# Altium project ADMDSP.PrjPCB
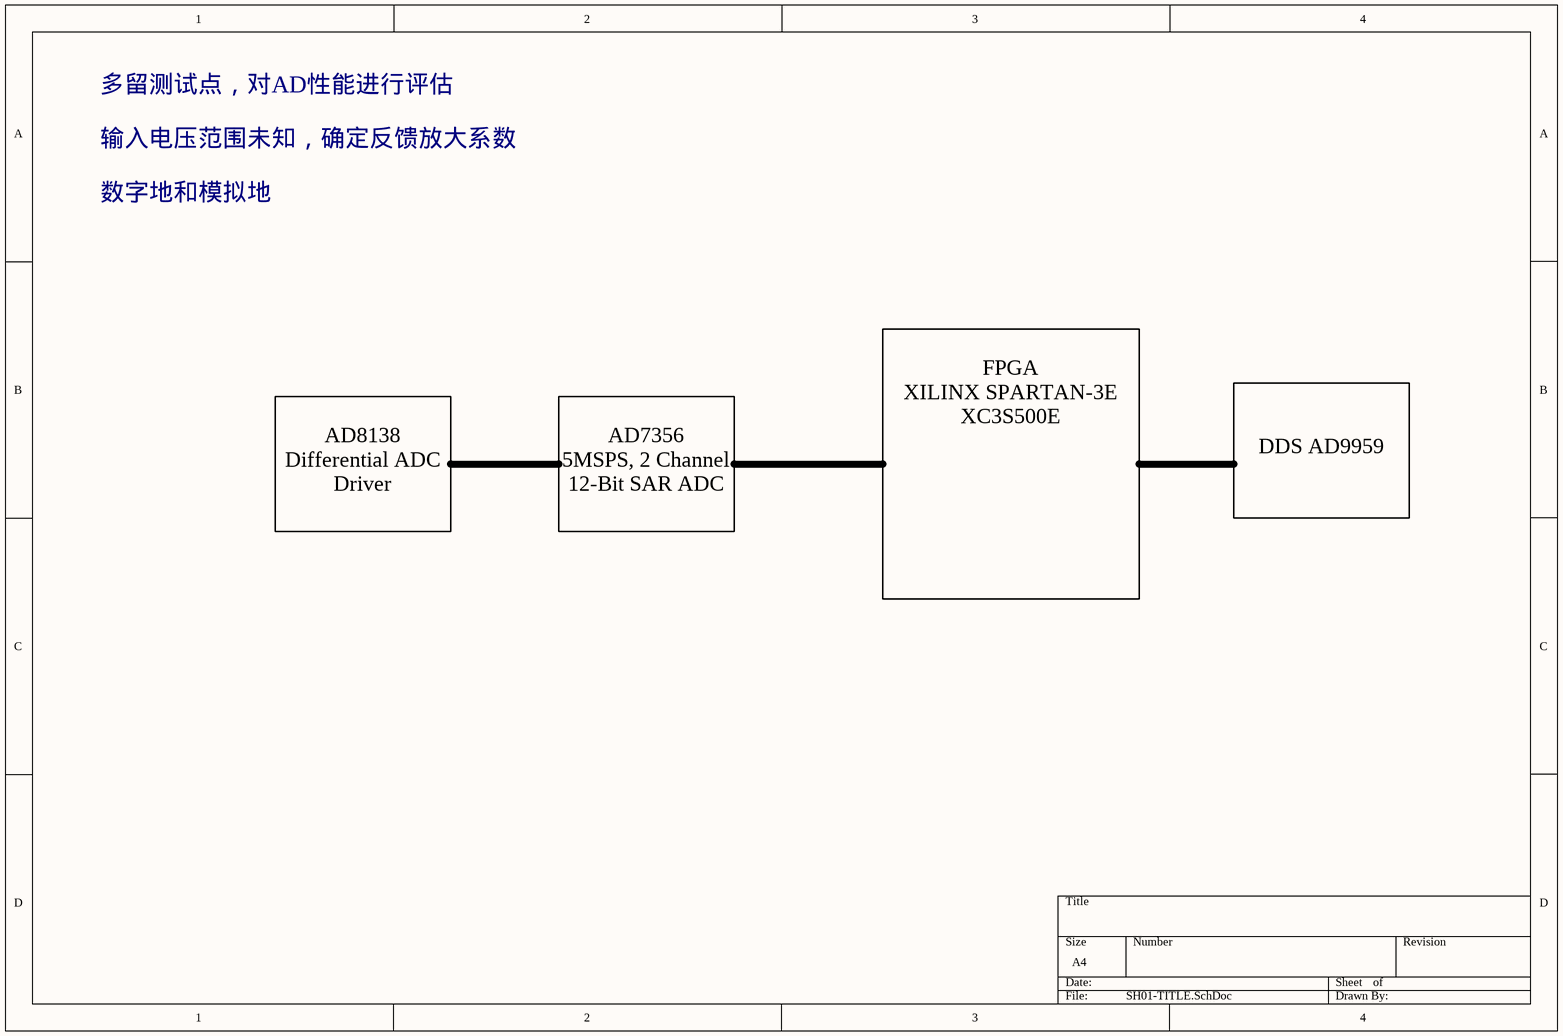
[diagram p0: SH01-TITLE.SchDoc]
10 sheets, 288 parts. Net scope: global (net labels, ports and power ports of the same name join across sheets).
Board file: AMDDSP.PcbDoc
Sheets:
  SH01-TITLE.SchDoc
  SH02-PERI.SchDoc
  SH03-AD.SchDoc
  SH04-DSP.SchDoc
  SH06-UI.SchDoc
  SH05-DDS.SchDoc
  SH07-COREPWR.SchDoc
  SH08-PWR1.SchDoc
  SH09-PWR2.SchDoc
  SH10-ASSI.SchDoc

## Sheet SH01-TITLE.SchDoc
size A4

### Notes on the sheet
- 多留测试点，对AD性能进行评估
- 输入电压范围未知，确定反馈放大系数
- 数字地和模拟地
- DDS AD9959
- AD8138
  Differential ADC
  Driver
- AD7356
  5MSPS, 2 Channel
  12-Bit SAR ADC
- FPGA
  XILINX SPARTAN-3E
  XC3S500E

## Sheet SH02-PERI.SchDoc
size A4
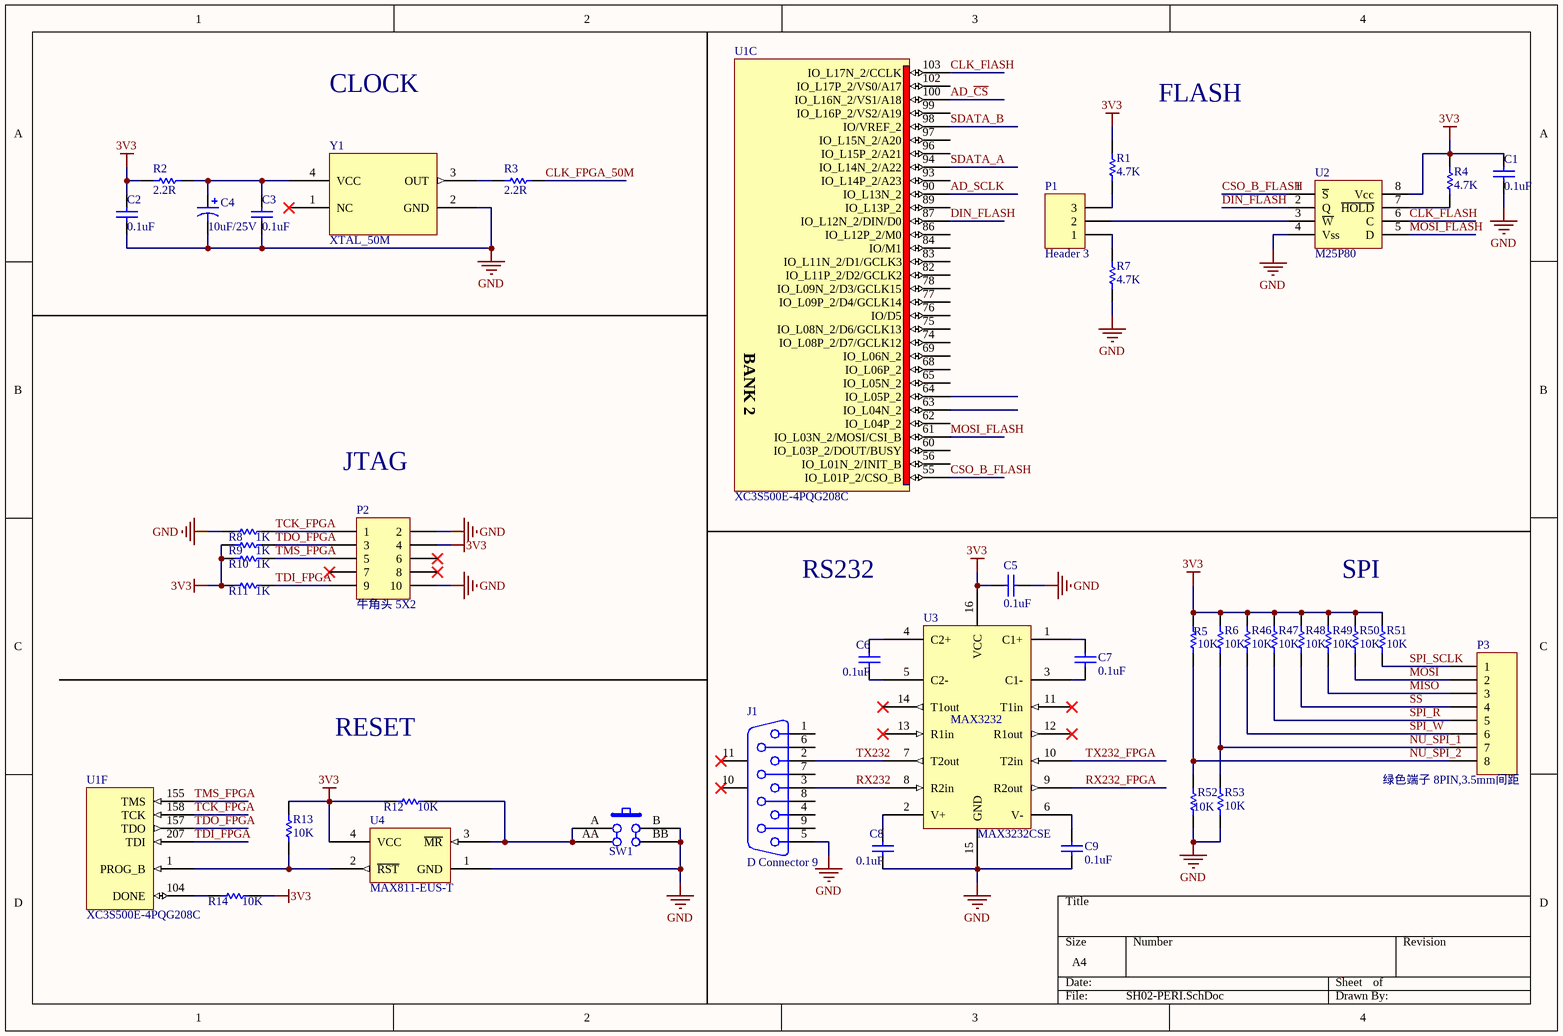
[diagram p1: SH02-PERI.SchDoc]

### Parts
(Parts that share a designator on the sheet are numbered #1, #2 ... from top to bottom, then left to right.)
C1  value 0.1uF  [1608[0603]]  (hidden comment: Cap,0.1uF/0603)
C2  value 0.1uF  [1608[0603]]  (hidden comment: Cap,0.1uF/0603)
C3  value 0.1uF  [1608[0603]]  (hidden comment: Cap,0.1uF/0603)
C4  value 10uF/25V  [1206[3216]]  (hidden comment: Cap Pol,10uF/25V,1206)
C5  value 0.1uF  [1608[0603]]  (hidden comment: Cap,0.1uF/0603)
C6  value 0.1uF  [1608[0603]]  (hidden comment: Cap,0.1uF/0603)
C7  value 0.1uF  [1608[0603]]  (hidden comment: Cap,0.1uF/0603)
C8  value 0.1uF  [1608[0603]]  (hidden comment: Cap,0.1uF/0603)
C9  value 0.1uF  [1608[0603]]  (hidden comment: Cap,0.1uF/0603)
J1  D Connector 9  [DSUB1.385-2H9]
P1  Header 3  [HDR1X3]
P2  牛角头 5X2  [10Pin - JTAG]
P3  绿色端子 8PIN,3.5mm间距  [8PIN]
R1  value 4.7K  [1608[0603]]  (hidden comment: Res,4.7K/0603)
R2  value 2.2R  [1608[0603]]  (hidden comment: Res,2.2R/0603)
R3  value 2.2R  [1608[0603]]  (hidden comment: Res,2.2R/0603)
R4  value 4.7K  [1608[0603]]  (hidden comment: Res,4.7K/0603)
R5  value 10K  [1608[0603]]  (hidden comment: Res,10K/0603)
R6  value 10K  [1608[0603]]  (hidden comment: Res,10K/0603)
R7  value 4.7K  [1608[0603]]  (hidden comment: Res,4.7K/0603)
R8  value 1K  [1608[0603]]  (hidden comment: Res,1K/0603)
R9  value 1K  [1608[0603]]  (hidden comment: Res,1K/0603)
R10  value 1K  [1608[0603]]  (hidden comment: Res,1K/0603)
R11  value 1K  [1608[0603]]  (hidden comment: Res,1K/0603)
R12  value 10K  [1608[0603]]  (hidden comment: Res,10K/0603)
R13  value 10K  [1608[0603]]  (hidden comment: Res,10K/0603)
R14  value 10K  [1608[0603]]  (hidden comment: Res,10K/0603)
R46#1  value 10K  [1608[0603]]  (hidden comment: Res,10K/0603)
R47#1  value 10K  [1608[0603]]  (hidden comment: Res,10K/0603)
R48  value 10K  [1608[0603]]  (hidden comment: Res,10K/0603)
R49  value 10K  [1608[0603]]  (hidden comment: Res,10K/0603)
R50  value 10K  [1608[0603]]  (hidden comment: Res,10K/0603)
R51  value 10K  [1608[0603]]  (hidden comment: Res,10K/0603)
R52  value 10K  [1608[0603]]  (hidden comment: Res,10K/0603,NoPoP)
R53  value 10K  [1608[0603]]  (hidden comment: Res,10K/0603,NoPoP)
SW1  SW,EVQPLMA15_1  [PUSHBUTTONSW]  (value not drawn)
U1  XC3S500E-4PQG208C  [PQG208_N]  (parts C,F of 8)
U2  M25P80  [SOIC127P600X175-8N]
U3  MAX3232CSE  [NSO16]
U4  MAX811-EUS-T  [SOT143]
Y1  XTAL_50M  [CRY_4Pin_50M]

### Nets
3V3: C1.1 C2.1 C5.1 P2.4 R1.2 R2.1 R4.2 R5.1 R6.1 R9.2 R10.2 R11.2 R12.2 R13.1 R14.1 R46#1.1 R47#1.1 R48.1 R49.1 R50.1 R51.1 U2.8(Vcc) U3.16(VCC) U4.4(VCC)
GND: C1.2 C2.2 C3.2 C4.2 C5.2 C8.2 C9.1 J1.5 P2.2 P2.10 R7.1 R8.2 R52.2 R53.2 SW1.B SW1.BB U2.4(Vss) U3.15(GND) U4.1(GND) Y1.2(GND)
AD_~{CS}: U1.100(IO_L16N_2/VS1/A18)
AD_SCLK: U1.90(IO_L13N_2)
CLK_FLASH: U1.103(IO_L17N_2/CCLK) U2.6(C)
CLK_FPGA_50M: R3.2
CSO_B_FLASH: U1.55(IO_L01P_2/CSO_B) U2.1(~{S})
DIN_FLASH: U1.87(IO_L12N_2/DIN/D0) U2.2(Q)
MISO: P3.3 R49.2
MOSI: P3.2 R50.2
MOSI_FLASH: U1.61(IO_L03N_2/MOSI/CSI_B) U2.5(D)
NU_SPI_1: P3.7 R6.2 R53.1
NU_SPI_2: P3.8 R5.2 R52.1
RX232: J1.3 U3.8(R2in)
RX232_FPGA: U3.9(R2out)
SDATA_A: U1.94(IO_L14N_2/A22)
SDATA_B: U1.98(IO/VREF_2)
SPI_R: P3.5 R47#1.2
SPI_SCLK: P3.1 R51.2
SPI_W: P3.6 R46#1.2
SS: P3.4 R48.2
TCK_FPGA: P2.1 R8.1 U1.158(TCK)
TDI_FPGA: P2.9 R11.1 U1.207(TDI)
TDO_FPGA: P2.3 R9.1 U1.157(TDO)
TMS_FPGA: P2.5 R10.1 U1.155(TMS)
TX232: J1.2 U3.7(T2out)
TX232_FPGA: U3.10(T2in)
NetC3_1: C3.1 C4.1 R2.2 Y1.4(VCC)
NetC6_1: C6.1 U3.4(C2+)
NetC6_2: C6.2 U3.5(C2-)
NetC7_1: C7.1 U3.3(C1-)
NetC7_2: C7.2 U3.1(C1+)
NetC8_1: C8.1 U3.2(V+)
NetC9_2: C9.2 U3.6(V-)
NetP1_1: P1.1 R7.2
NetP1_2: P1.2 U2.3(~{W})
NetP1_3: P1.3 R1.1
NetR3_1: R3.1 Y1.3(OUT)
NetR4_1: R4.1 U2.7(~{HOLD})
NetR12_1: R12.1 SW1.A SW1.AA U4.3(~{MR})
NetR13_2: R13.2 U1.1(PROG_B) U4.2(~{RST})
NetR14_2: R14.2 U1.104(DONE)

Not connected (* = marked no-connect by the designer): J1 1 4 6 7 8 9 10(MH1)* 11(MH2)*; P2 6* 7* 8*; U1 56(IO_L01N_2/INIT_B) 60(IO_L03P_2/DOUT/BUSY) 62(IO_L04P_2) 63(IO_L04N_2) 64(IO_L05P_2) 65(IO_L05N_2) 68(IO_L06P_2) 69(IO_L06N_2) 74(IO_L08P_2/D7/GCLK12) 75(IO_L08N_2/D6/GCLK13) 76(IO/D5) 77(IO_L09P_2/D4/GCLK14) 78(IO_L09N_2/D3/GCLK15) 82(IO_L11P_2/D2/GCLK2) 83(IO_L11N_2/D1/GCLK3) 84(IO/M1) 86(IO_L12P_2/M0) 89(IO_L13P_2) 93(IO_L14P_2/A23) 96(IO_L15P_2/A21) 97(IO_L15N_2/A20) 99(IO_L16P_2/VS2/A19) 102(IO_L17P_2/VS0/A17); U3 11(T1in)* 12(R1out)* 13(R1in)* 14(T1out)*; Y1 1(NC)*

### Notes on the sheet
- CLOCK
- FLASH
- JTAG
- RS232
- SPI
- RESET
- (in symbol XC3S500E-4PQG208C, part C) BANK 2

### Library data of the parts
C1-C3 C5-C9 = Cap: Capacitor; Published: 8-Jun-2000; LatestRevisionDate: 17-Jul-2002; LatestRevisionNote: Re-released for DXP Platform.; PackageReference: RAD-0.3; Publisher: Altium Limited
C4 = Cap Pol1: Polarized Capacitor (Radial); Published: 8-Jun-2000; LatestRevisionDate: 17-Jul-2002; LatestRevisionNote: Re-released for DXP Platform.; PackageReference: RB7.6-15; Publisher: Altium Limited
J1 = D Connector 9: Receptacle Assembly, 9 Position, Right Angle; PackageDocument: O; Positions: 9; Published: 15-Jun-2001; LatestRevisionDate: 17-Jul-2002; LatestRevisionNote: Re-released for DXP Platform.; DatasheetDocument: 1-Sep-1999; PackageReference: 788750; Publisher: Altium Limited; Orientation: Right Angle; Gender: Receptacle
P1 = Header 3: Header, 3-Pin; LatestRevisionDate: 17-Jul-2002; LatestRevisionNote: Re-released for DXP Platform.; Publisher: Altium Limited
P2 = Header 5X2: Header, 5-Pin, Dual row; LatestRevisionDate: 17-Jul-2002; LatestRevisionNote: Re-released for DXP Platform.; Publisher: Altium Limited
P3 = Header 8: Header, 8-Pin; LatestRevisionDate: 17-Jul-2002; LatestRevisionNote: Re-released for DXP Platform.; Publisher: Altium Limited
R1-R14 R46#1 R47#1 R48-R53 = Res1: Resistor; Published: 8-Jun-2000; LatestRevisionDate: 17-Jul-2002; LatestRevisionNote: Re-released for DXP Platform.; PackageReference: AXIAL-0.3; Publisher: Altium Limited
SW1 = PUSHBUTTON SW
U1 = XC3S500E-4PQG208C: Spartan-3E 1.2V FPGA, 158 User I/Os, 208-Pin Pb-Free PQFP, Standard Performance, Commercial Grade; Published: 6-Jun-2005; LatestRevisionDate: 13-Apr-2006; LatestRevisionNote: IPC-7351 Footprint Added.; DatasheetVersion: 16-Mar-2007; PackageVersion: ver1.2, Jun-2004; PackageReference: PQG208; Publisher: Altium Limited; PackageDescription: 208-Pin Plastic Quad Flat Pack (PQG208) - Pb-Free; Code_JEDEC: MS-029-FA-1; ComponentLink1Description: Manufacturer Link; ComponentLink1URL: http://www.xilinx.com/products/silicon_solutions/fpgas/spartan_series/spartan3e_fpgas/index.htm; ComponentLink2Description: Datasheet; ComponentLink2URL: http://direct.xilinx.com/bvdocs/publications/ds312.pdf
U3 = MAX3232: Text Field1: 60; Text Field2: 150
U4 = MAX811
Y1 = XTAL

## Sheet SH03-AD.SchDoc
size A4
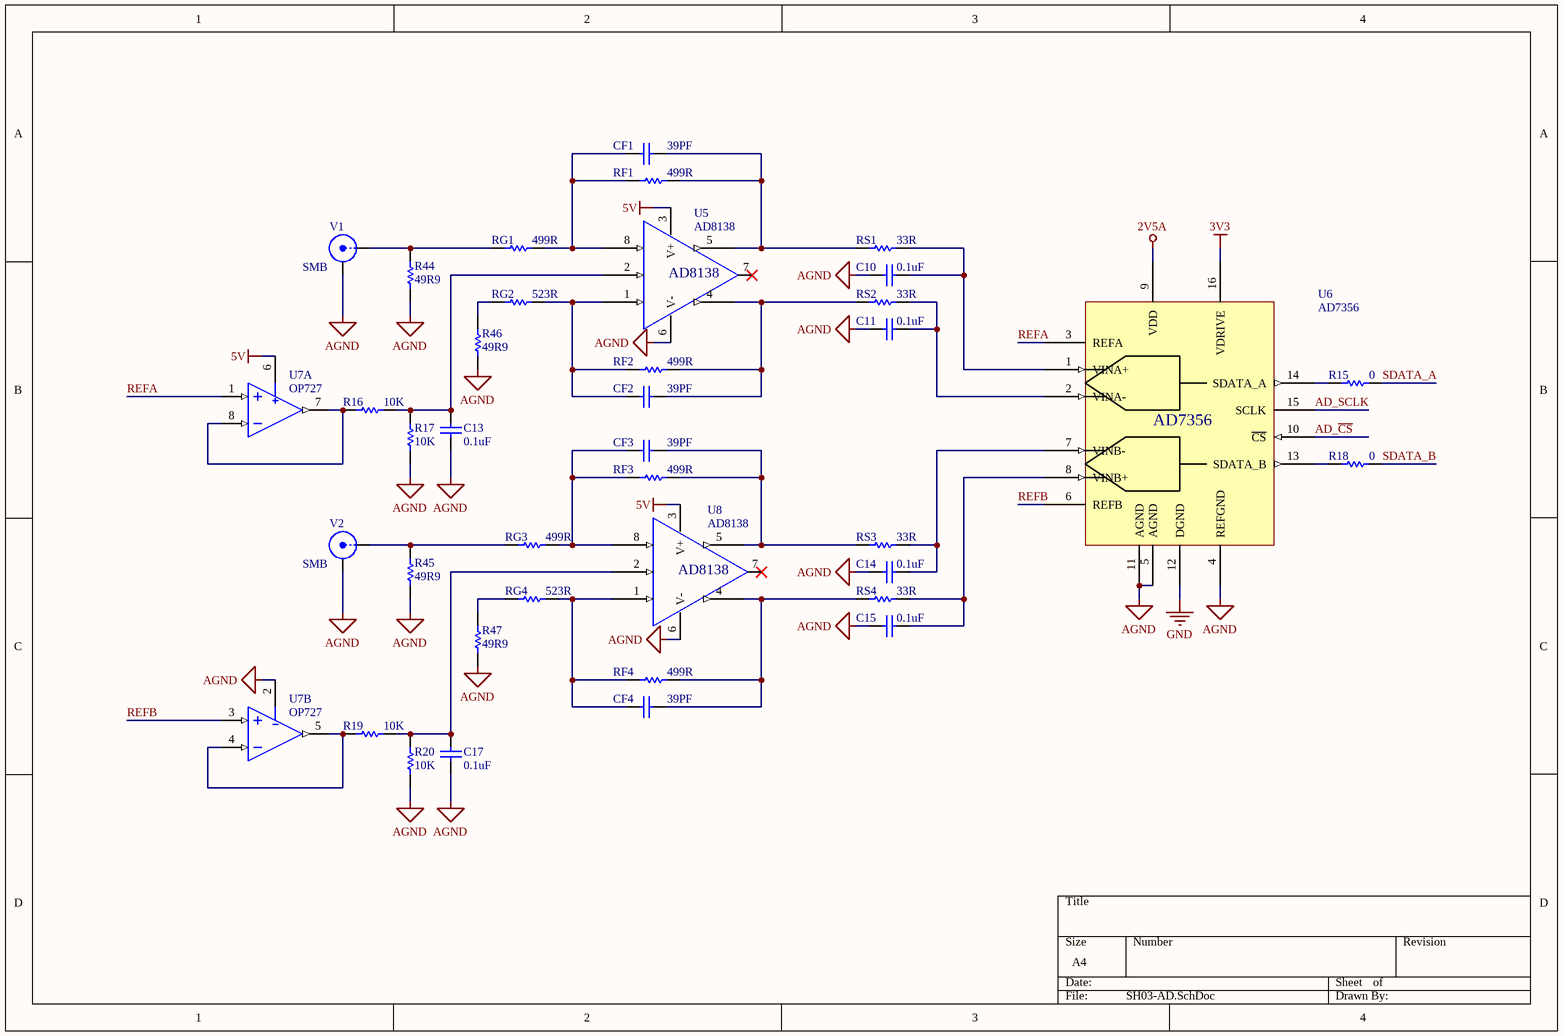
[diagram p2: SH03-AD.SchDoc]

### Parts
(Parts that share a designator on the sheet are numbered #1, #2 ... from top to bottom, then left to right.)
C10  value 0.1uF  [1608[0603]]  (hidden comment: Cap,0.1uF/0603)
C11  value 0.1uF  [1608[0603]]  (hidden comment: Cap,0.1uF/0603)
C13  value 0.1uF  [1608[0603]]  (hidden comment: Cap,0.1uF/0603)
C14  value 0.1uF  [1608[0603]]  (hidden comment: Cap,0.1uF/0603)
C15  value 0.1uF  [1608[0603]]  (hidden comment: Cap,0.1uF/0603)
C17  value 0.1uF  [1608[0603]]  (hidden comment: Cap,0.1uF/0603)
CF1  value 39PF  [1608[0603]]  (hidden comment: Cap,39PF/0603)
CF2  value 39PF  [1608[0603]]  (hidden comment: Cap,39PF/0603)
CF3  value 39PF  [1608[0603]]  (hidden comment: Cap,39PF/0603)
CF4  value 39PF  [1608[0603]]  (hidden comment: Cap,39PF/0603)
R15  value 0  [1608[0603]]  (hidden comment: Res,0R/0603)
R16  value 10K  [1608[0603]]  (hidden comment: Res,10K/0603)
R17  value 10K  [1608[0603]]  (hidden comment: Res,10K/0603)
R18  value 0  [1608[0603]]  (hidden comment: Res,0R/0603)
R19  value 10K  [1608[0603]]  (hidden comment: Res,10K/0603)
R20  value 10K  [1608[0603]]  (hidden comment: Res,10K/0603)
R44  value 49R9  [1608[0603]]  (hidden comment: Res,49R9/0603)
R45  value 49R9  [1608[0603]]  (hidden comment: Res,49R9/0603)
R46#2  value 49R9  [1608[0603]]  (hidden comment: Res,49R9/0603)
R47#2  value 49R9  [1608[0603]]  (hidden comment: Res,49R9/0603)
RF1  value 499R  [1608[0603]]  (hidden comment: Res,499R/0603)
RF2  value 499R  [1608[0603]]  (hidden comment: Res,499R/0603)
RF3  value 499R  [1608[0603]]  (hidden comment: Res,499R/0603)
RF4  value 499R  [1608[0603]]  (hidden comment: Res,499R/0603)
RG1  value 499R  [1608[0603]]  (hidden comment: Res,499R/0603)
RG2  value 523R  [1608[0603]]  (hidden comment: Res,523R/0603)
RG3  value 499R  [1608[0603]]  (hidden comment: Res,499R/0603)
RG4  value 523R  [1608[0603]]  (hidden comment: Res,523R/0603)
RS1  value 33R  [1608[0603]]  (hidden comment: Res,33R/0603)
RS2  value 33R  [1608[0603]]  (hidden comment: Res,33R/0603)
RS3  value 33R  [1608[0603]]  (hidden comment: Res,33R/0603)
RS4  value 33R  [1608[0603]]  (hidden comment: Res,33R/0603)
U5  AD8138  [SOIC127P600X175-8N]
U6  AD7356  [TSOP65P640X120-16N]
U7  OP727  [SOIC127P600X175-8N]  (parts A,B of 2)
U8  AD8138  [SOIC127P600X175-8N]
V1  SMB  [SMB_V-RJ45]
V2  SMB  [SMB_V-RJ45]

### Nets
2V5A: U6.9(VDD)
3V3: U6.16(VDRIVE)
5V: U5.3(V+) U7.6(V+) U8.3(V+)  [project net A_LCD]
AGND: C10.2 C11.2 C13.2 C14.2 C15.2 C17.2 R17.1 R20.1 R44.2 R45.2 R46#2.2 R47#2.2 U5.6(V-) U6.4(REFGND) U6.5(AGND) U6.11(AGND) U7.2(V-) U8.6(V-) V1.2(Y) V2.2(Y)
GND: U6.12(DGND)
AD_~{CS}: U6.10(~{CS})
AD_SCLK: U6.15(SCLK)
REFA: U6.3(REFA) U7.1(+INA)
REFB: U6.6(REFB) U7.3(+INB)
SDATA_A: R15.2
SDATA_B: R18.2
NetC10_1: C10.1 RS1.1 U6.1(VINA+)
NetC11_1: C11.1 RS2.1 U6.2(VINA-)
NetC13_1: C13.1 R16.2 R17.2 U5.2(VOCM)
NetC14_1: C14.1 RS3.1 U6.7(VINB-)
NetC15_1: C15.1 RS4.1 U6.8(VINB+)
NetC17_1: C17.1 R19.2 R20.2 U8.2(VOCM)
NetCF1_1: CF1.1 RF1.1 RS1.2 U5.5(-OUT)
NetCF1_2: CF1.2 RF1.2 RG1.1 U5.8(+IN)
NetCF2_1: CF2.1 RF2.1 RS2.2 U5.4(+OUT)
NetCF2_2: CF2.2 RF2.2 RG2.1 U5.1(-IN)
NetCF3_1: CF3.1 RF3.1 RS3.2 U8.5(-OUT)
NetCF3_2: CF3.2 RF3.2 RG3.1 U8.8(+IN)
NetCF4_1: CF4.1 RF4.1 RS4.2 U8.4(+OUT)
NetCF4_2: CF4.2 RF4.2 RG4.1 U8.1(-IN)
NetR15_1: R15.1 U6.14(SDATA_A)
NetR16_1: R16.1 U7.7(OUTA) U7.8(-INA)
NetR18_1: R18.1 U6.13(SDATA_B)
NetR19_1: R19.1 U7.4(-INB) U7.5(OUTB)
NetR44_1: R44.1 RG1.2 V1.1(X)
NetR45_1: R45.1 RG3.2 V2.1(X)
NetR46#2_1: R46#2.1 RG2.2
NetR47#2_1: R47#2.1 RG4.2

Not connected (* = marked no-connect by the designer): U5 7(NC)*; U8 7(NC)*

### Library data of the parts
C10 C11 C13-C15 C17 CF1-CF4 = Cap: Capacitor; Published: 8-Jun-2000; LatestRevisionDate: 17-Jul-2002; LatestRevisionNote: Re-released for DXP Platform.; PackageReference: RAD-0.3; Publisher: Altium Limited
R15-R20 R44 R45 R46#2 R47#2 RF1-RF4 RG1-RG4 RS1-RS4 = Res1: Resistor; Published: 8-Jun-2000; LatestRevisionDate: 17-Jul-2002; LatestRevisionNote: Re-released for DXP Platform.; PackageReference: AXIAL-0.3; Publisher: Altium Limited
U5 U8 = AD8138: Low Distortion  Differential ADC Driver; Note: Pin 2 is analog ground; Published: 8-Jun-2000; LatestRevisionDate: 04-Mar-2005; LatestRevisionNote: Stylized 3D Model Added.; DatasheetVersion: REV.B 1998; PackageVersion: revA; PackageReference: N-8; Publisher: Altium Limited; PackageDescription: DIP; 8 Leads; Row Spacing 7.62 mm; Pitch 2.54 mm; ComponentLink1Description: Manufacturer Link; ComponentLink1URL: http://www.analog.com/en/prod/0%2C2877%2CAD626%2C00.html; ComponentLink2Description: Datasheet; ComponentLink2URL: http://www.analog.com/UploadedFiles/Data_Sheets/441354443AD626_d.pdf
U6 = AD7356: Differential Input, Dual, Simultaneous  Sampling, 5 MSPS, 12-Bit, SAR ADC
U7 = AMP_OP727: Precision Micropower  Single-Supply Operational Amplifiers; Published: 8-Jun-2000; LatestRevisionDate: 17-Jul-2002; LatestRevisionNote: Re-released for DXP Platform.; DatasheetVersion: 1992; PackageVersion: revC, 1990; PackageReference: H-12A; Publisher: Altium Limited; PackageDescription: Can; 12 Leads; 10.16 mm Square Array; Lead Dia. 0.53 mm (max); ComponentLink1Description: Manufacturer Link; ComponentLink1URL: http://www.analog.com/
V1 V2 = SMB: SMB Straight Connector; LatestRevisionDate: 17-Jul-2002; LatestRevisionNote: Re-released for DXP Platform.; Publisher: Altium Limited

## Sheet SH04-DSP.SchDoc
size A4
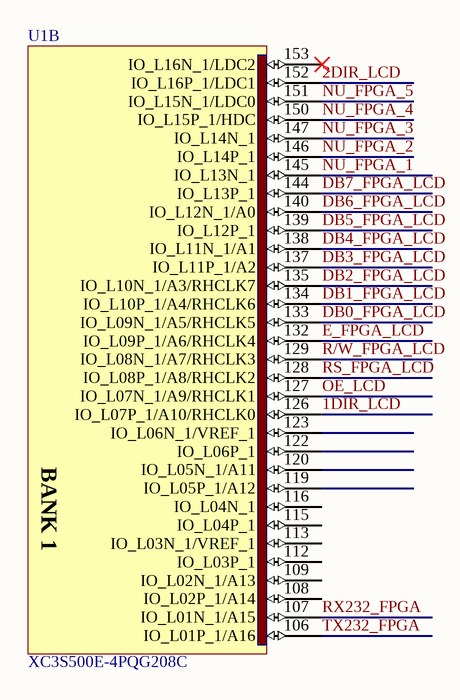
[diagram p3: SH04-DSP.SchDoc]

### Parts
U1  XC3S500E-4PQG208C  [PQG208_N]  (part B of 8)

### Nets
1DIR_LCD: U1.126(IO_L07P_1/A10/RHCLK0)
2DIR_LCD: U1.152(IO_L16P_1/LDC1)
DB0_FPGA_LCD: U1.133(IO_L09N_1/A5/RHCLK5)
DB1_FPGA_LCD: U1.134(IO_L10P_1/A4/RHCLK6)
DB2_FPGA_LCD: U1.135(IO_L10N_1/A3/RHCLK7)
DB3_FPGA_LCD: U1.137(IO_L11P_1/A2)
DB4_FPGA_LCD: U1.138(IO_L11N_1/A1)
DB5_FPGA_LCD: U1.139(IO_L12P_1)
DB6_FPGA_LCD: U1.140(IO_L12N_1/A0)
DB7_FPGA_LCD: U1.144(IO_L13P_1)
E_FPGA_LCD: U1.132(IO_L09P_1/A6/RHCLK4)
NU_FPGA_1: U1.145(IO_L13N_1)
NU_FPGA_2: U1.146(IO_L14P_1)
NU_FPGA_3: U1.147(IO_L14N_1)
NU_FPGA_4: U1.150(IO_L15P_1/HDC)
NU_FPGA_5: U1.151(IO_L15N_1/LDC0)
~{OE}_LCD: U1.127(IO_L07N_1/A9/RHCLK1)
R/W_FPGA_LCD: U1.129(IO_L08N_1/A7/RHCLK3)
RS_FPGA_LCD: U1.128(IO_L08P_1/A8/RHCLK2)
RX232_FPGA: U1.107(IO_L01N_1/A15)
TX232_FPGA: U1.106(IO_L01P_1/A16)

Not connected (* = marked no-connect by the designer): U1 108(IO_L02P_1/A14) 109(IO_L02N_1/A13) 112(IO_L03P_1) 113(IO_L03N_1/VREF_1) 115(IO_L04P_1) 116(IO_L04N_1) 119(IO_L05P_1/A12) 120(IO_L05N_1/A11) 122(IO_L06P_1) 123(IO_L06N_1/VREF_1) 153(IO_L16N_1/LDC2)*

### Notes on the sheet
- (in symbol XC3S500E-4PQG208C, part B) BANK 1

### Library data of the parts
U1 = XC3S500E-4PQG208C: as U1 on sheet SH02-PERI; Published: 6-Jun-2005; LatestRevisionDate: 13-Apr-2006; LatestRevisionNote: IPC-7351 Footprint Added.; DatasheetVersion: 16-Mar-2007; PackageVersion: ver1.2, Jun-2004; PackageReference: PQG208; Publisher: Altium Limited; PackageDescription: 208-Pin Plastic Quad Flat Pack (PQG208) - Pb-Free; Code_JEDEC: MS-029-FA-1; ComponentLink1Description: Manufacturer Link; ComponentLink1URL: http://www.xilinx.com/products/silicon_solutions/fpgas/spartan_series/spartan3e_fpgas/index.htm; ComponentLink2Description: Datasheet; ComponentLink2URL: http://direct.xilinx.com/bvdocs/publications/ds312.pdf

## Sheet SH06-UI.SchDoc
size A4
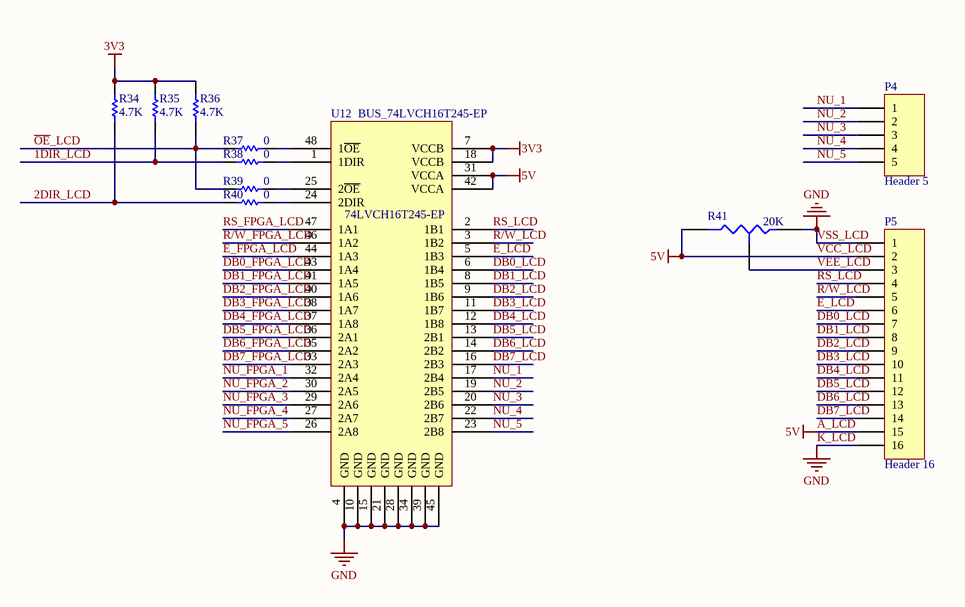
[diagram p4: SH06-UI.SchDoc]

### Parts
P4  Header 5  [HDR1X5]
P5  Header 16  [HDR1X16]
R34  value 4.7K  [1608[0603]]  (hidden comment: Res,4.7K/0603)
R35  value 4.7K  [1608[0603]]  (hidden comment: Res,4.7K/0603)
R36  value 4.7K  [1608[0603]]  (hidden comment: Res,4.7K/0603)
R37  value 0  [1608[0603]]  (hidden comment: Res,0R/0603)
R38  value 0  [1608[0603]]  (hidden comment: Res,0R/0603)
R39  value 0  [1608[0603]]  (hidden comment: Res,0R/0603)
R40  value 0  [1608[0603]]  (hidden comment: Res,0R/0603)
R41  value 20K  [RES-adj]  (hidden comment: Res Adj,20K)
U12  BUS_74LVCH16T245-EP  [TSSOP50P810X120-48N]

### Nets
3V3: R34.2 R35.2 R36.2 U12.7(VCCB) U12.18(VCCB)
A_LCD: P5.2 P5.15 R41.2(B) U12.31(VCCA) U12.42(VCCA)  [also labelled 5V, VCC_LCD]
GND: P5.1 P5.16 R41.1(A) U12.4(GND) U12.10(GND) U12.15(GND) U12.21(GND) U12.28(GND) U12.34(GND) U12.39(GND) U12.45(GND)  [also labelled K_LCD, VSS_LCD]
1DIR_LCD: R35.1 R38.1
2DIR_LCD: R34.1 R40.1
DB0_FPGA_LCD: U12.43(1A4)
DB0_LCD: P5.7 U12.6(1B4)
DB1_FPGA_LCD: U12.41(1A5)
DB1_LCD: P5.8 U12.8(1B5)
DB2_FPGA_LCD: U12.40(1A6)
DB2_LCD: P5.9 U12.9(1B6)
DB3_FPGA_LCD: U12.38(1A7)
DB3_LCD: P5.10 U12.11(1B7)
DB4_FPGA_LCD: U12.37(1A8)
DB4_LCD: P5.11 U12.12(1B8)
DB5_FPGA_LCD: U12.36(2A1)
DB5_LCD: P5.12 U12.13(2B1)
DB6_FPGA_LCD: U12.35(2A2)
DB6_LCD: P5.13 U12.14(2B2)
DB7_FPGA_LCD: U12.33(2A3)
DB7_LCD: P5.14 U12.16(2B3)
E_FPGA_LCD: U12.44(1A3)
E_LCD: P5.6 U12.5(1B3)
NU_1: P4.1 U12.17(2B4)
NU_2: P4.2 U12.19(2B5)
NU_3: P4.3 U12.20(2B6)
NU_4: P4.4 U12.22(2B7)
NU_5: P4.5 U12.23(2B8)
NU_FPGA_1: U12.32(2A4)
NU_FPGA_2: U12.30(2A5)
NU_FPGA_3: U12.29(2A6)
NU_FPGA_4: U12.27(2A7)
NU_FPGA_5: U12.26(2A8)
~{OE}_LCD: R36.1 R37.1 R39.1
R/W_FPGA_LCD: U12.46(1A2)
R/W_LCD: P5.5 U12.3(1B2)
RS_FPGA_LCD: U12.47(1A1)
RS_LCD: P5.4 U12.2(1B1)
VEE_LCD: P5.3 R41.3(TAP)
NetR37_2: R37.2 U12.48(1~{OE})
NetR38_2: R38.2 U12.1(1DIR)
NetR39_2: R39.2 U12.25(2~{OE})
NetR40_2: R40.2 U12.24(2DIR)

### Notes on the sheet
- (in symbol BUS_74LVCH16T245-EP) 74LVCH16T245-EP

### Library data of the parts
P4 = Header 5: Header, 5-Pin; LatestRevisionDate: 17-Jul-2002; LatestRevisionNote: Re-released for DXP Platform.; Publisher: Altium Limited
P5 = Header 16: Header, 16-Pin; LatestRevisionDate: 17-Jul-2002; LatestRevisionNote: Re-released for DXP Platform.; Publisher: Altium Limited
R34-R40 = Res1: Resistor; Published: 8-Jun-2000; LatestRevisionDate: 17-Jul-2002; LatestRevisionNote: Re-released for DXP Platform.; PackageReference: AXIAL-0.3; Publisher: Altium Limited
R41 = Res Tap: Tapped Resistor; Sim Note: Enter the Resistance value and the set point into parameter fields.; Set Position: 0.5; Published: 24-Mar-1999; LatestRevisionDate: 17-Jul-2002; LatestRevisionNote: Re-released for DXP Platform.; PackageReference: VR3; Publisher: Altium Limited

## Sheet SH05-DDS.SchDoc: ADM_PHASE_FPGA
size A4
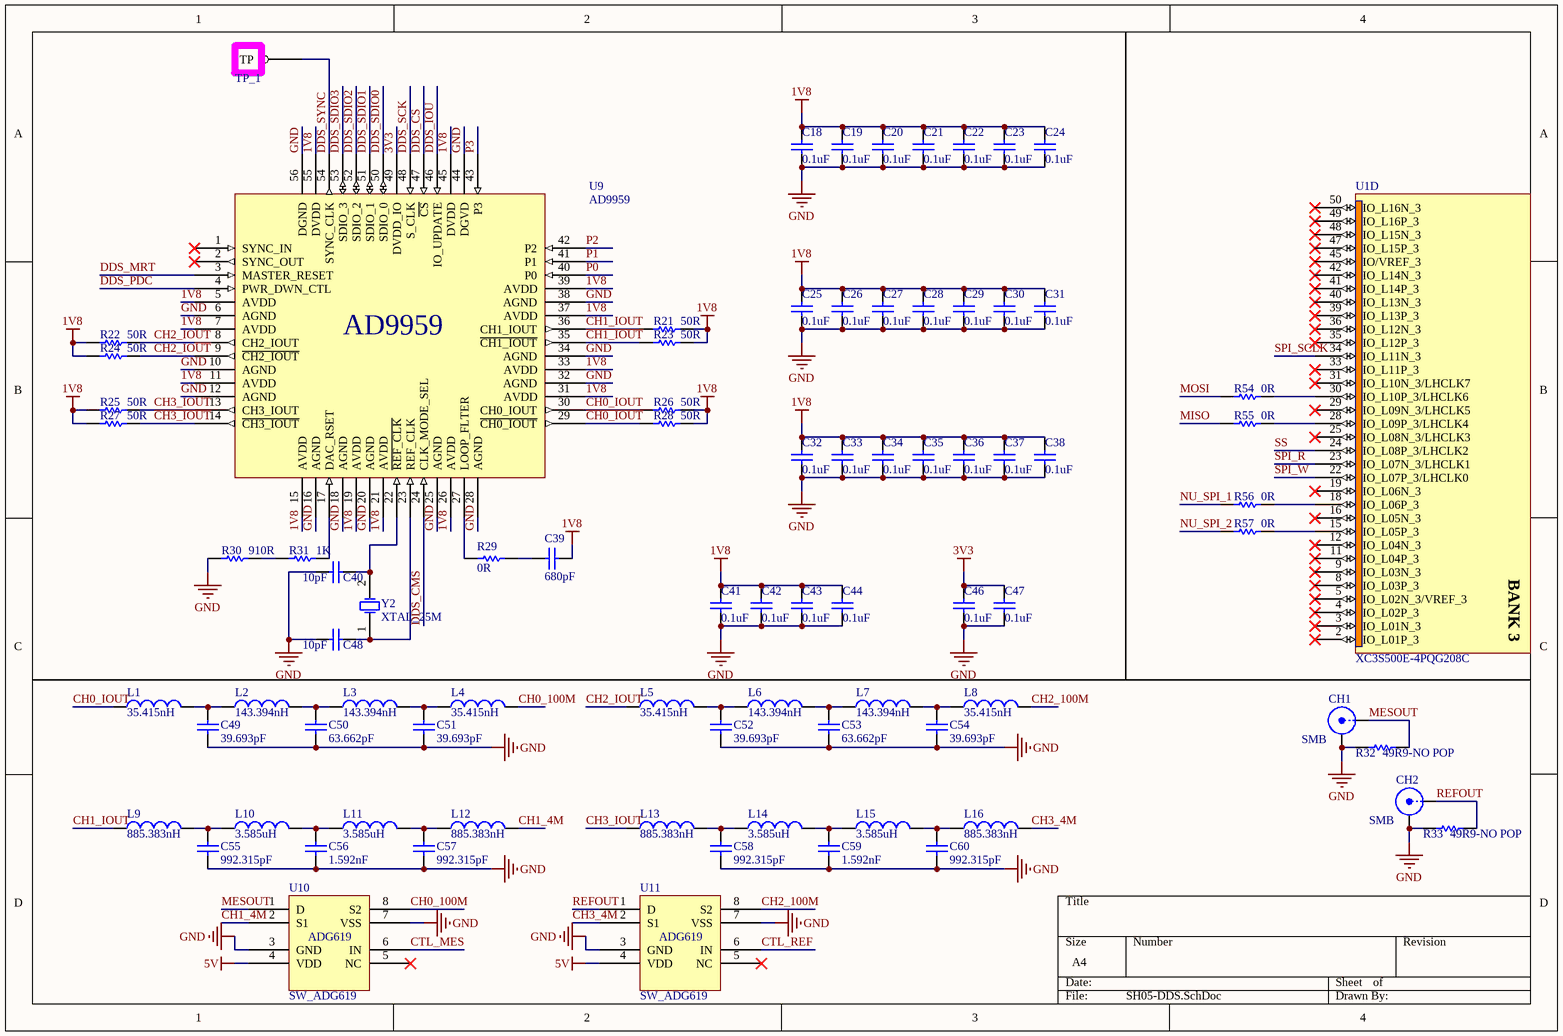
[diagram p5: SH05-DDS.SchDoc]

### Parts
C18  value 0.1uF  [1608[0603] - NoTopOverlay]  (hidden comment: Cap,0.1uF/0603)
C19  value 0.1uF  [1608[0603] - NoTopOverlay]  (hidden comment: Cap,0.1uF/0603)
C20  value 0.1uF  [1608[0603] - NoTopOverlay]  (hidden comment: Cap,0.1uF/0603)
C21  value 0.1uF  [1608[0603] - NoTopOverlay]  (hidden comment: Cap,0.1uF/0603)
C22  value 0.1uF  [1608[0603] - NoTopOverlay]  (hidden comment: Cap,0.1uF/0603)
C23  value 0.1uF  [1608[0603] - NoTopOverlay]  (hidden comment: Cap,0.1uF/0603)
C24  value 0.1uF  [1608[0603] - NoTopOverlay]  (hidden comment: Cap,0.1uF/0603)
C25  value 0.1uF  [1608[0603] - NoTopOverlay]  (hidden comment: Cap,0.1uF/0603)
C26  value 0.1uF  [1608[0603] - NoTopOverlay]  (hidden comment: Cap,0.1uF/0603)
C27  value 0.1uF  [1608[0603] - NoTopOverlay]  (hidden comment: Cap,0.1uF/0603)
C28  value 0.1uF  [1608[0603] - NoTopOverlay]  (hidden comment: Cap,0.1uF/0603)
C29  value 0.1uF  [1608[0603] - NoTopOverlay]  (hidden comment: Cap,0.1uF/0603)
C30  value 0.1uF  [1608[0603] - NoTopOverlay]  (hidden comment: Cap,0.1uF/0603)
C31  value 0.1uF  [1608[0603] - NoTopOverlay]  (hidden comment: Cap,0.1uF/0603)
C32  value 0.1uF  [1608[0603] - NoTopOverlay]  (hidden comment: Cap,0.1uF/0603)
C33  value 0.1uF  [1608[0603] - NoTopOverlay]  (hidden comment: Cap,0.1uF/0603)
C34  value 0.1uF  [1608[0603] - NoTopOverlay]  (hidden comment: Cap,0.1uF/0603)
C35  value 0.1uF  [1608[0603] - NoTopOverlay]  (hidden comment: Cap,0.1uF/0603)
C36  value 0.1uF  [1608[0603] - NoTopOverlay]  (hidden comment: Cap,0.1uF/0603)
C37  value 0.1uF  [1608[0603] - NoTopOverlay]  (hidden comment: Cap,0.1uF/0603)
C38  value 0.1uF  [1608[0603] - NoTopOverlay]  (hidden comment: Cap,0.1uF/0603)
C39  value 680pF  [1608[0603] - NoTopOverlay]  (hidden comment: Cap,680pF/0603)
C40  value 10pF  [1608[0603] - NoTopOverlay]  (hidden comment: Cap,10pF/0603)
C41  value 0.1uF  [1608[0603] - NoTopOverlay]  (hidden comment: Cap,0.1uF/0603)
C42  value 0.1uF  [1608[0603] - NoTopOverlay]  (hidden comment: Cap,0.1uF/0603)
C43  value 0.1uF  [1608[0603] - NoTopOverlay]  (hidden comment: Cap,0.1uF/0603)
C44  value 0.1uF  [1608[0603] - NoTopOverlay]  (hidden comment: Cap,0.1uF/0603)
C46  value 0.1uF  [1608[0603] - NoTopOverlay]  (hidden comment: Cap,0.1uF/0603)
C47  value 0.1uF  [1608[0603] - NoTopOverlay]  (hidden comment: Cap,0.1uF/0603)
C48  value 10pF  [1608[0603] - NoTopOverlay]  (hidden comment: Cap,10pF/0603)
C49  value 39.693pF  [1608[0603] - NoTopOverlay]  (hidden comment: Cap,39.693pF/0603)
C50  value 63.662pF  [1608[0603] - NoTopOverlay]  (hidden comment: Cap,63.662pF/0603)
C51  value 39.693pF  [1608[0603] - NoTopOverlay]  (hidden comment: Cap,39.693pF/0603)
C52  value 39.693pF  [1608[0603] - NoTopOverlay]  (hidden comment: Cap,39.693pF/0603)
C53  value 63.662pF  [1608[0603] - NoTopOverlay]  (hidden comment: Cap,63.662pF/0603)
C54  value 39.693pF  [1608[0603] - NoTopOverlay]  (hidden comment: Cap,39.693pF/0603)
C55  value 992.315pF  [1608[0603] - NoTopOverlay]  (hidden comment: Cap,992.315pF/0603)
C56  value 1.592nF  [1608[0603] - NoTopOverlay]  (hidden comment: Cap,1.592nF/0603)
C57  value 992.315pF  [1608[0603] - NoTopOverlay]  (hidden comment: Cap,992.315pF/0603)
C58  value 992.315pF  [1608[0603] - NoTopOverlay]  (hidden comment: Cap,992.315pF/0603)
C59  value 1.592nF  [1608[0603] - NoTopOverlay]  (hidden comment: Cap,1.592nF/0603)
C60  value 992.315pF  [1608[0603] - NoTopOverlay]  (hidden comment: Cap,992.315pF/0603)
CH1  SMB  [SMB_V-RJ45]
CH2  SMB  [SMB_V-RJ45]
L1  value 35.415nH  [2012[0805] - NoTopOverlay]  (hidden comment: Inductor,L0805,35.415nH)
L2  value 143.394nH  [2012[0805] - NoTopOverlay]  (hidden comment: Inductor,L0805,143.394nH)
L3  value 143.394nH  [2012[0805] - NoTopOverlay]  (hidden comment: Inductor,L0805,143.394nH)
L4  value 35.415nH  [2012[0805] - NoTopOverlay]  (hidden comment: Inductor,L0805,35.415nH)
L5  value 35.415nH  [2012[0805] - NoTopOverlay]  (hidden comment: Inductor,L0805,35.415nH)
L6  value 143.394nH  [2012[0805] - NoTopOverlay]  (hidden comment: Inductor,L0805,143.394nH)
L7  value 143.394nH  [2012[0805] - NoTopOverlay]  (hidden comment: Inductor,L0805,143.394nH)
L8  value 35.415nH  [2012[0805] - NoTopOverlay]  (hidden comment: Inductor,L0805,35.415nH)
L9  value 885.383nH  [2012[0805] - NoTopOverlay]  (hidden comment: Inductor,L0805,885.383nH)
L10  value 3.585uH  [2012[0805] - NoTopOverlay]  (hidden comment: Inductor,L0805,3.585uH)
L11  value 3.585uH  [2012[0805] - NoTopOverlay]  (hidden comment: Inductor,L0805,3.585uH)
L12  value 885.383nH  [2012[0805] - NoTopOverlay]  (hidden comment: Inductor,L0805,885.383nH)
L13  value 885.383nH  [2012[0805] - NoTopOverlay]  (hidden comment: Inductor,L0805,885.383nH)
L14  value 3.585uH  [2012[0805] - NoTopOverlay]  (hidden comment: Inductor,L0805,3.585uH)
L15  value 3.585uH  [2012[0805] - NoTopOverlay]  (hidden comment: Inductor,L0805,3.585uH)
L16  value 885.383nH  [2012[0805] - NoTopOverlay]  (hidden comment: Inductor,L0805,885.383nH)
R21  value 50R  [1608[0603] - NoTopOverlay]  (hidden comment: Res,50R/0603)
R22  value 50R  [1608[0603] - NoTopOverlay]  (hidden comment: Res,50R/0603)
R23  value 50R  [1608[0603] - NoTopOverlay]  (hidden comment: Res,50R/0603)
R24  value 50R  [1608[0603] - NoTopOverlay]  (hidden comment: Res,50R/0603)
R25  value 50R  [1608[0603] - NoTopOverlay]  (hidden comment: Res,50R/0603)
R26  value 50R  [1608[0603] - NoTopOverlay]  (hidden comment: Res,50R/0603)
R27  value 50R  [1608[0603] - NoTopOverlay]  (hidden comment: Res,50R/0603)
R28  value 50R  [1608[0603] - NoTopOverlay]  (hidden comment: Res,50R/0603)
R29  value 0R  [1608[0603] - NoTopOverlay]  (hidden comment: Res,0R/0603)
R30  value 910R  [1608[0603] - NoTopOverlay]  (hidden comment: Res,910R/0603)
R31  value 1K  [1608[0603] - NoTopOverlay]  (hidden comment: Res,1K/0805)
R32  value 49R9-NO POP  [1608[0603] - NoTopOverlay]  (hidden comment: Res,49R9/0603)
R33  value 49R9-NO POP  [1608[0603] - NoTopOverlay]  (hidden comment: Res,49R9/0603)
R54  value 0R  [1608[0603] - NoTopOverlay]  (hidden comment: Res,0R/0603)
R55  value 0R  [1608[0603] - NoTopOverlay]  (hidden comment: Res,0R/0603)
R56  value 0R  [1608[0603] - NoTopOverlay]  (hidden comment: Res,0R/0603)
R57  value 0R  [1608[0603] - NoTopOverlay]  (hidden comment: Res,0R/0603)
TP_1  TP_DDS_SYNC_CLK  [MYTP]  (value not drawn)
U1  XC3S500E-4PQG208C  [PQG208_N]  (part D of 8)
U9  AD9959  [CP-56]
U10  SW_ADG619  [SOT23D]
U11  SW_ADG619  [SOT23D]
Y2  XTAL_25M  [XTAL2]

### Nets
1V8: C18.1 C19.1 C20.1 C21.1 C22.1 C23.1 C24.1 C25.1 C26.1 C27.1 C28.1 C29.1 C30.1 C31.1 C32.1 C33.1 C34.1 C35.1 C36.1 C37.1 C38.1 C39.1 C41.1 C42.1 C43.1 C44.1 R21.2 R22.1 R23.2 R24.1 R25.1 R26.2 R27.1 R28.2 U9.5(AVDD) U9.7(AVDD) U9.11(AVDD) U9.15(AVDD) U9.19(AVDD) U9.21(AVDD) U9.26(AVDD) U9.31(AVDD) U9.33(AVDD) U9.37(AVDD) U9.39(AVDD) U9.45(DVDD) U9.55(DVDD)
3V3: C46.1 C47.1 U9.49(DVDD_IO)
5V: U10.4(VDD) U11.4(VDD)  [project net A_LCD]
GND: C18.2 C19.2 C20.2 C21.2 C22.2 C23.2 C24.2 C25.2 C26.2 C27.2 C28.2 C29.2 C30.2 C31.2 C32.2 C33.2 C34.2 C35.2 C36.2 C37.2 C38.2 C40.1 C41.2 C42.2 C43.2 C44.2 C46.2 C47.2 C48.2 C49.2 C50.2 C51.2 C52.2 C53.2 C54.2 C55.2 C56.2 C57.2 C58.2 C59.2 C60.2 CH1.2(Y) CH2.2(Y) R30.2 R32.2 R33.2 U9.6(AGND) U9.10(AGND) U9.12(AGND) U9.16(AGND) U9.18(AGND) U9.20(AGND) U9.25(AGND) U9.28(AGND) U9.32(AGND) U9.34(AGND) U9.38(AGND) U9.44(DGVD) U9.56(DGND) U10.3(GND) U10.7(VSS) U11.3(GND) U11.7(VSS)
~{CH0_IOUT}: R28.1 U9.29(~{CH0_IOUT})
~{CH1_IOUT}: R23.1 U9.35(~{CH1_IOUT})
~{CH2_IOUT}: R24.2 U9.9(~{CH2_IOUT})
~{CH3_IOUT}: R27.2 U9.14(~{CH3_IOUT})
CH0_100M: L4.2 U10.8(S2)
CH0_IOUT: L1.1 R26.1 U9.30(CH0_IOUT)
CH1_4M: L12.2 U10.2(S1)
CH1_IOUT: L9.1 R21.1 U9.36(CH1_IOUT)
CH2_100M: L8.2 U11.8(S2)
CH2_IOUT: L5.1 R22.2 U9.8(CH2_IOUT)
CH3_4M: L16.2 U11.2(S1)
CH3_IOUT: L13.1 R25.2 U9.13(CH3_IOUT)
CTL_MES: U10.6(IN)
CTL_REF: U11.6(IN)
DDS~{_CS}: U9.47(~{CS})
DDS_CMS: U9.24(CLK_MODE_SEL)
DDS_IOU: U9.46(IO_UPDATE)
DDS_MRT: U9.3(MASTER_RESET)
DDS_PDC: U9.4(PWR_DWN_CTL)
DDS_SCK: U9.48(S_CLK)
DDS_SDIO0: U9.50(SDIO_0)
DDS_SDIO1: U9.51(SDIO_1)
DDS_SDIO2: U9.52(SDIO_2)
DDS_SDIO3: U9.53(SDIO_3)
DDS_SYNC: TP_1.1(TP) U9.54(SYNC_CLK)
MESOUT: CH1.1(X) R32.1 U10.1(D)
MISO: R55.2
MOSI: R54.2
NU_SPI_1: R56.2
NU_SPI_2: R57.2
P0: U9.40(P0)
P1: U9.41(P1)
P2: U9.42(P2)
P3: U9.43(P3)
REFOUT: CH2.1(X) R33.1 U11.1(D)
SPI_R: U1.23(IO_L07N_3/LHCLK1)
SPI_SCLK: U1.34(IO_L11N_3)
SPI_W: U1.22(IO_L07P_3/LHCLK0)
SS: U1.24(IO_L08P_3/LHCLK2)
NetC39_2: C39.2 R29.1
NetC40_2: C40.2 U9.22(~{REF_CLK}) Y2.2(OSC2)
NetC48_1: C48.1 U9.23(REF_CLK) Y2.1(OSC1)
NetC49_1: C49.1 L1.2 L2.1
NetC50_1: C50.1 L2.2 L3.1
NetC51_1: C51.1 L3.2 L4.1
NetC52_1: C52.1 L5.2 L6.1
NetC53_1: C53.1 L6.2 L7.1
NetC54_1: C54.1 L7.2 L8.1
NetC55_1: C55.1 L9.2 L10.1
NetC56_1: C56.1 L10.2 L11.1
NetC57_1: C57.1 L11.2 L12.1
NetC58_1: C58.1 L13.2 L14.1
NetC59_1: C59.1 L14.2 L15.1
NetC60_1: C60.1 L15.2 L16.1
NetR29_2: R29.2 U9.27(LOOP_FLTER)
NetR30_1: R30.1 R31.2
NetR31_1: R31.1 U9.17(DAC_RSET)
NetR54_1: R54.1 U1.30(IO_L10P_3/LHCLK6)
NetR55_1: R55.1 U1.28(IO_L09P_3/LHCLK4)
NetR56_1: R56.1 U1.18(IO_L06P_3)
NetR57_1: R57.1 U1.15(IO_L05P_3)

Not connected (* = marked no-connect by the designer): U1 2(IO_L01P_3)* 3(IO_L01N_3)* 4(IO_L02P_3)* 5(IO_L02N_3/VREF_3)* 8(IO_L03P_3)* 9(IO_L03N_3)* 11(IO_L04P_3)* 12(IO_L04N_3)* 16(IO_L05N_3)* 19(IO_L06N_3)* 25(IO_L08N_3/LHCLK3)* 29(IO_L09N_3/LHCLK5)* 31(IO_L10N_3/LHCLK7)* 33(IO_L11P_3)* 35(IO_L12P_3)* 36(IO_L12N_3)* 39(IO_L13P_3)* 40(IO_L13N_3)* 41(IO_L14P_3)* 42(IO_L14N_3)* 45(IO/VREF_3)* 47(IO_L15P_3)* 48(IO_L15N_3)* 49(IO_L16P_3)* 50(IO_L16N_3)*; U9 1(SYNC_IN)* 2(SYNC_OUT)*; U10 5(NC)*; U11 5(NC)*

### Notes on the sheet
- (in symbol SW_ADG619) ADG619
- (in symbol XC3S500E-4PQG208C, part D) BANK 3

### Library data of the parts
C18-C44 C46-C60 = Cap: Capacitor; Published: 8-Jun-2000; LatestRevisionDate: 17-Jul-2002; LatestRevisionNote: Re-released for DXP Platform.; PackageReference: RAD-0.3; Publisher: Altium Limited
CH1 CH2 = SMB: SMB Straight Connector; LatestRevisionDate: 17-Jul-2002; LatestRevisionNote: Re-released for DXP Platform.; Publisher: Altium Limited
L1-L16 = Inductor: Code_IEC: 1005; Published: 8-Jun-2000; LatestRevisionDate: 17-Jul-2002; LatestRevisionNote: Re-released for DXP Platform.; PackageReference: 0402-A; Publisher: Altium Limited; Code_JEITA: 0402
R21-R33 R54-R57 = Res1: Resistor; Published: 8-Jun-2000; LatestRevisionDate: 17-Jul-2002; LatestRevisionNote: Re-released for DXP Platform.; PackageReference: AXIAL-0.3; Publisher: Altium Limited
TP_1 = TEST POINT_0: Right: 10; Bottom: 20
U1 = XC3S500E-4PQG208C: as U1 on sheet SH02-PERI; Published: 6-Jun-2005; LatestRevisionDate: 13-Apr-2006; LatestRevisionNote: IPC-7351 Footprint Added.; DatasheetVersion: 16-Mar-2007; PackageVersion: ver1.2, Jun-2004; PackageReference: PQG208; Publisher: Altium Limited; PackageDescription: 208-Pin Plastic Quad Flat Pack (PQG208) - Pb-Free; Code_JEDEC: MS-029-FA-1; ComponentLink1Description: Manufacturer Link; ComponentLink1URL: http://www.xilinx.com/products/silicon_solutions/fpgas/spartan_series/spartan3e_fpgas/index.htm; ComponentLink2Description: Datasheet; ComponentLink2URL: http://direct.xilinx.com/bvdocs/publications/ds312.pdf
U9 = DDS_AD9959
U10 U11 = SW_ADG619: Single SPDT Switches
Y2 = XTAL: Crystal Oscillator; Published: 8-Jun-2000; LatestRevisionDate: 17-Jul-2002; LatestRevisionNote: Re-released for DXP Platform.; PackageReference: R38; Publisher: Altium Limited

## Sheet SH07-COREPWR.SchDoc
size A4
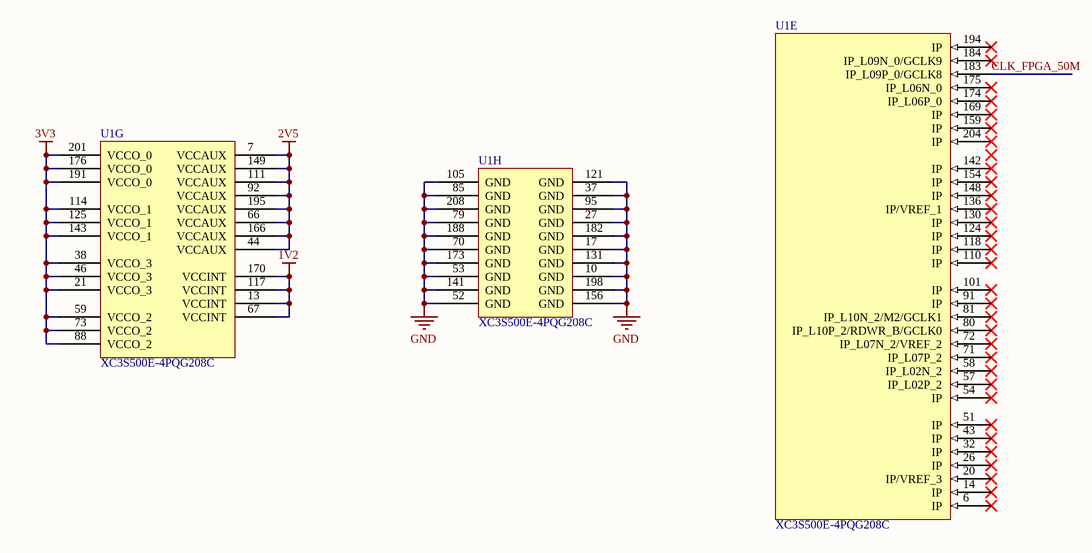
[diagram p6: SH07-COREPWR.SchDoc]

### Parts
U1  XC3S500E-4PQG208C  [PQG208_N]  (parts E,G,H of 8)

### Nets
1V2: U1.13(VCCINT) U1.67(VCCINT) U1.117(VCCINT) U1.170(VCCINT)
2V5: U1.7(VCCAUX) U1.44(VCCAUX) U1.66(VCCAUX) U1.92(VCCAUX) U1.111(VCCAUX) U1.149(VCCAUX) U1.166(VCCAUX) U1.195(VCCAUX)
3V3: U1.21(VCCO_3) U1.38(VCCO_3) U1.46(VCCO_3) U1.59(VCCO_2) U1.73(VCCO_2) U1.88(VCCO_2) U1.114(VCCO_1) U1.125(VCCO_1) U1.143(VCCO_1) U1.176(VCCO_0) U1.191(VCCO_0) U1.201(VCCO_0)
GND: U1.10(GND) U1.17(GND) U1.27(GND) U1.37(GND) U1.52(GND) U1.53(GND) U1.70(GND) U1.79(GND) U1.85(GND) U1.95(GND) U1.105(GND) U1.121(GND) U1.131(GND) U1.141(GND) U1.156(GND) U1.173(GND) U1.182(GND) U1.188(GND) U1.198(GND) U1.208(GND)
CLK_FPGA_50M: U1.183(IP_L09P_0/GCLK8)

Not connected (* = marked no-connect by the designer): U1 6(IP)* 14(IP)* 20(IP/VREF_3)* 26(IP)* 32(IP)* 43(IP)* 51(IP)* 54(IP)* 57(IP_L02P_2)* 58(IP_L02N_2)* 71(IP_L07P_2)* 72(IP_L07N_2/VREF_2)* 80(IP_L10P_2/RDWR_B/GCLK0)* 81(IP_L10N_2/M2/GCLK1)* 91(IP)* 101(IP)* 110(IP)* 118(IP)* 124(IP)* 130(IP)* 136(IP/VREF_1)* 142(IP)* 148(IP)* 154(IP)* 159(IP)* 169(IP)* 174(IP_L06P_0)* 175(IP_L06N_0)* 184(IP_L09N_0/GCLK9)* 194(IP)* 204(IP)*

### Library data of the parts
U1 = XC3S500E-4PQG208C: as U1 on sheet SH02-PERI; Published: 6-Jun-2005; LatestRevisionDate: 13-Apr-2006; LatestRevisionNote: IPC-7351 Footprint Added.; DatasheetVersion: 16-Mar-2007; PackageVersion: ver1.2, Jun-2004; PackageReference: PQG208; Publisher: Altium Limited; PackageDescription: 208-Pin Plastic Quad Flat Pack (PQG208) - Pb-Free; Code_JEDEC: MS-029-FA-1; ComponentLink1Description: Manufacturer Link; ComponentLink1URL: http://www.xilinx.com/products/silicon_solutions/fpgas/spartan_series/spartan3e_fpgas/index.htm; ComponentLink2Description: Datasheet; ComponentLink2URL: http://direct.xilinx.com/bvdocs/publications/ds312.pdf

## Sheet SH08-PWR1.SchDoc
size A4
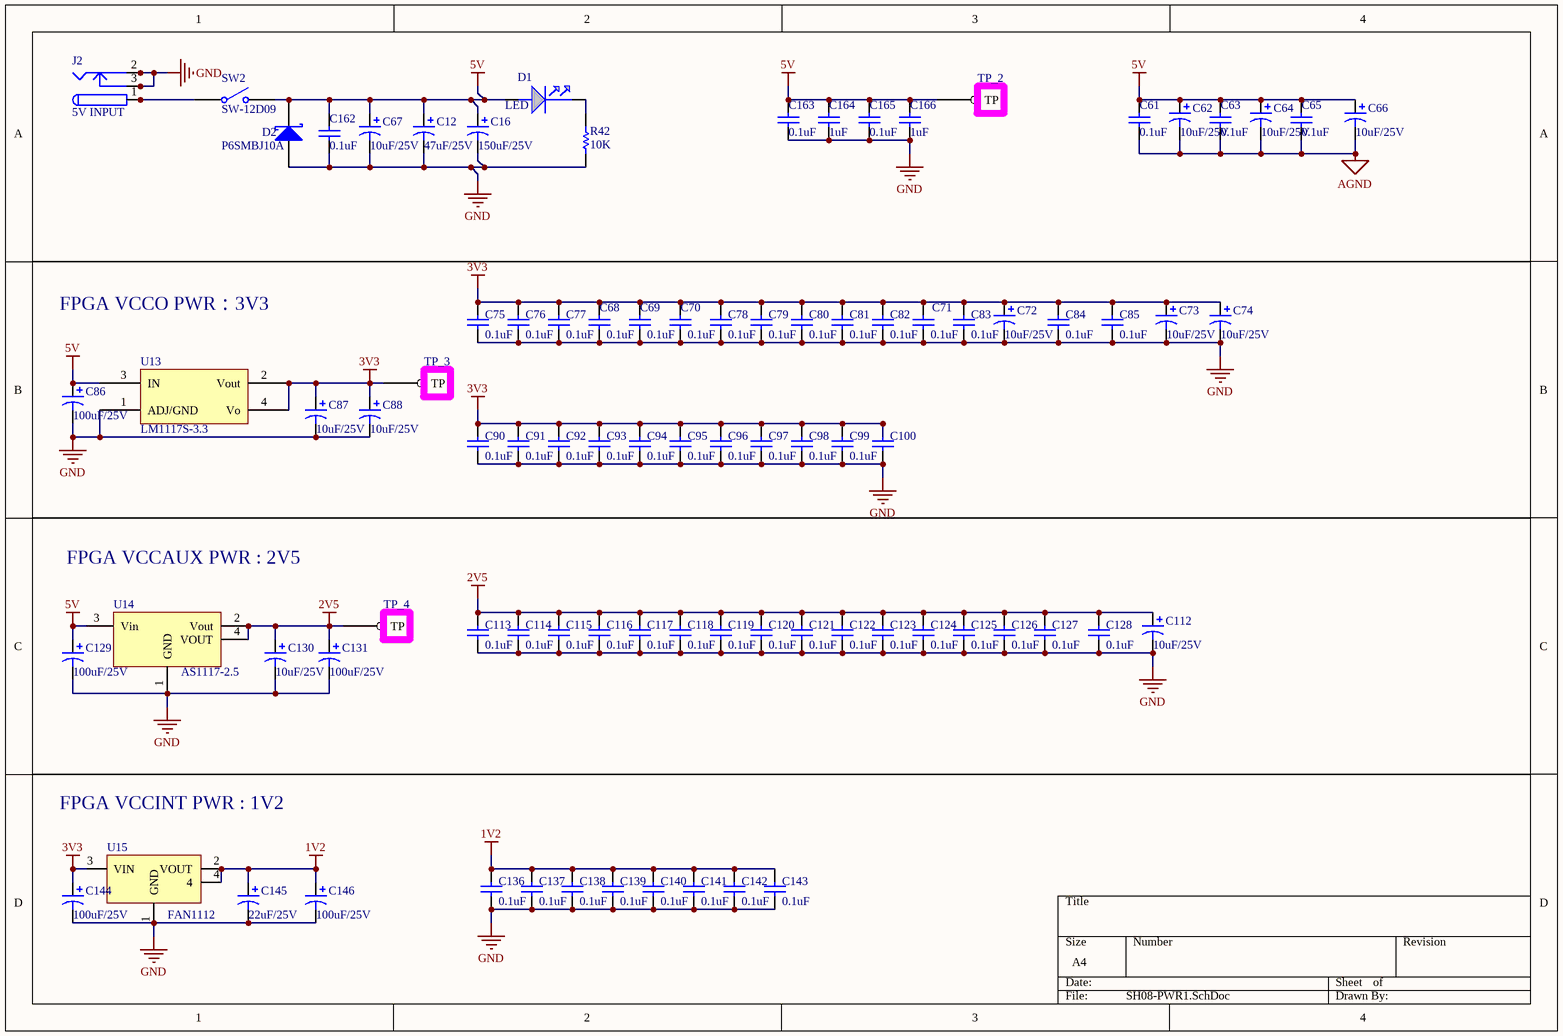
[diagram p7: SH08-PWR1.SchDoc]

### Parts
C12  value 47uF/25V  [1210[3528]]  (hidden comment: Cap Pol,47uF/25V,1210)
C16  value 150uF/25V  [7343]  (hidden comment: Cap Pol,150uF/25V,7343)
C61  value 0.1uF  [1608[0603]]  (hidden comment: Cap,0.1uF/0603)
C62  value 10uF/25V  [1206[3216]]  (hidden comment: Cap Pol,10uF/25V,1206)
C63  value 0.1uF  [1608[0603]]  (hidden comment: Cap,0.1uF/0603)
C64  value 10uF/25V  [1206[3216]]  (hidden comment: Cap Pol,10uF/25V,1206)
C65  value 0.1uF  [1608[0603]]  (hidden comment: Cap,0.1uF/0603)
C66  value 10uF/25V  [1206[3216]]  (hidden comment: Cap Pol,10uF/25V,1206)
C67  value 10uF/25V  [1206[3216]]  (hidden comment: Cap Pol,10uF/25V,1206)
C68  value 0.1uF  [1608[0603]]  (hidden comment: Cap,0.1uF/0603)
C69  value 0.1uF  [1608[0603]]  (hidden comment: Cap,0.1uF/0603)
C70  value 0.1uF  [1608[0603]]  (hidden comment: Cap,0.1uF/0603)
C71  value 0.1uF  [1608[0603]]  (hidden comment: Cap,0.1uF/0603)
C72  value 10uF/25V  [1206[3216]]  (hidden comment: Cap Pol,10uF/25V,1206)
C73  value 10uF/25V  [1206[3216]]  (hidden comment: Cap Pol,10uF/25V,1206)
C74  value 10uF/25V  [1206[3216]]  (hidden comment: Cap Pol,10uF/25V,1206)
C75  value 0.1uF  [1608[0603]]  (hidden comment: Cap,0.1uF/0603)
C76  value 0.1uF  [1608[0603]]  (hidden comment: Cap,0.1uF/0603)
C77  value 0.1uF  [1608[0603]]  (hidden comment: Cap,0.1uF/0603)
C78  value 0.1uF  [1608[0603]]  (hidden comment: Cap,0.1uF/0603)
C79  value 0.1uF  [1608[0603]]  (hidden comment: Cap,0.1uF/0603)
C80  value 0.1uF  [1608[0603]]  (hidden comment: Cap,0.1uF/0603)
C81  value 0.1uF  [1608[0603]]  (hidden comment: Cap,0.1uF/0603)
C82  value 0.1uF  [1608[0603]]  (hidden comment: Cap,0.1uF/0603)
C83  value 0.1uF  [1608[0603]]  (hidden comment: Cap,0.1uF/0603)
C84  value 0.1uF  [1608[0603]]  (hidden comment: Cap,0.1uF/0603)
C85  value 0.1uF  [1608[0603]]  (hidden comment: Cap,0.1uF/0603)
C86  value 100uF/25V  [1210[3528]]  (hidden comment: Cap Pol,100uF/25V,1210)
C87  value 10uF/25V  [1206[3216]]  (hidden comment: Cap Pol,10uF/25V,1206)
C88  value 10uF/25V  [1206[3216]]  (hidden comment: Cap Pol,10uF/25V,1206)
C90  value 0.1uF  [1608[0603]]  (hidden comment: Cap,0.1uF/0603)
C91  value 0.1uF  [1608[0603]]  (hidden comment: Cap,0.1uF/0603)
C92  value 0.1uF  [1608[0603]]  (hidden comment: Cap,0.1uF/0603)
C93  value 0.1uF  [1608[0603]]  (hidden comment: Cap,0.1uF/0603)
C94  value 0.1uF  [1608[0603]]  (hidden comment: Cap,0.1uF/0603)
C95  value 0.1uF  [1608[0603]]  (hidden comment: Cap,0.1uF/0603)
C96  value 0.1uF  [1608[0603]]  (hidden comment: Cap,0.1uF/0603)
C97  value 0.1uF  [1608[0603]]  (hidden comment: Cap,0.1uF/0603)
C98  value 0.1uF  [1608[0603]]  (hidden comment: Cap,0.1uF/0603)
C99  value 0.1uF  [1608[0603]]  (hidden comment: Cap,0.1uF/0603)
C100  Cap,0.1uF/0603  [1608[0603]]  (value not drawn)
C112  value 10uF/25V  [1206[3216]]  (hidden comment: Cap Pol,10uF/25V,1206)
C113  value 0.1uF  [1608[0603]]  (hidden comment: Cap,0.1uF/0603)
C114  value 0.1uF  [1608[0603]]  (hidden comment: Cap,0.1uF/0603)
C115  value 0.1uF  [1608[0603]]  (hidden comment: Cap,0.1uF/0603)
C116  value 0.1uF  [1608[0603]]  (hidden comment: Cap,0.1uF/0603)
C117  value 0.1uF  [1608[0603]]  (hidden comment: Cap,0.1uF/0603)
C118  value 0.1uF  [1608[0603]]  (hidden comment: Cap,0.1uF/0603)
C119  value 0.1uF  [1608[0603]]  (hidden comment: Cap,0.1uF/0603)
C120  value 0.1uF  [1608[0603]]  (hidden comment: Cap,0.1uF/0603)
C121  value 0.1uF  [1608[0603]]  (hidden comment: Cap,0.1uF/0603)
C122  value 0.1uF  [1608[0603]]  (hidden comment: Cap,0.1uF/0603)
C123  value 0.1uF  [1608[0603]]  (hidden comment: Cap,0.1uF/0603)
C124  value 0.1uF  [1608[0603]]  (hidden comment: Cap,0.1uF/0603)
C125  value 0.1uF  [1608[0603]]  (hidden comment: Cap,0.1uF/0603)
C126  value 0.1uF  [1608[0603]]  (hidden comment: Cap,0.1uF/0603)
C127  value 0.1uF  [1608[0603]]  (hidden comment: Cap,0.1uF/0603)
C128  value 0.1uF  [1608[0603]]  (hidden comment: Cap,0.1uF/0603)
C129  value 100uF/25V  [1210[3528]]  (hidden comment: Cap Pol,100uF/25V,1210)
C130  value 10uF/25V  [1206[3216]]  (hidden comment: Cap Pol,10uF/25V,1206)
C131  value 100uF/25V  [1210[3528]]  (hidden comment: Cap Pol,100uF/25V,1210)
C136  value 0.1uF  [1608[0603]]  (hidden comment: Cap,0.1uF/0603)
C137  value 0.1uF  [1608[0603]]  (hidden comment: Cap,0.1uF/0603)
C138  value 0.1uF  [1608[0603]]  (hidden comment: Cap,0.1uF/0603)
C139  value 0.1uF  [1608[0603]]  (hidden comment: Cap,0.1uF/0603)
C140  value 0.1uF  [1608[0603]]  (hidden comment: Cap,0.1uF/0603)
C141  value 0.1uF  [1608[0603]]  (hidden comment: Cap,0.1uF/0603)
C142  value 0.1uF  [1608[0603]]  (hidden comment: Cap,0.1uF/0603)
C143  value 0.1uF  [1608[0603]]  (hidden comment: Cap,0.1uF/0603)
C144  value 100uF/25V  [1210[3528]]  (hidden comment: Cap Pol,100uF/25V,1210)
C145  value 22uF/25V  [1210[3528]]  (hidden comment: Cap Pol,22uF/25V,1210)
C146  value 100uF/25V  [1210[3528]]  (hidden comment: Cap Pol,100uF/25V,1210)
C162  value 0.1uF  [1608[0603]]  (hidden comment: Cap,0.1uF/0603)
C163  value 0.1uF  [1608[0603]]  (hidden comment: Cap,0.1uF/0603)
C164  value 1uF  [2012[0805]]  (hidden comment: Cap,1uF/0805)
C165  value 0.1uF  [1608[0603]]  (hidden comment: Cap,0.1uF/0603)
C166  value 1uF  [2012[0805]]  (hidden comment: Cap,1uF/0805)
D1  LED  [2012[0805] - LED]
D2  P6SMBJ10A  [SMBJ10A_DIOM4336X24N]
J2  5V INPUT  [IF_KLD-0202]
R42  value 10K  [1608[0603]]  (hidden comment: Res,10K/0603)
SW2  SW-12D09  [SW_SD12D09]
TP_2  5V  [MYTP]  (value not drawn)
TP_3  3V3  [MYTP]  (value not drawn)
TP_4  2V5  [MYTP]  (value not drawn)
U13  LM1117S-3.3  [TO-263-3SMD]
U14  AS1117-2.5  [SOT223P700X180-4N]
U15  FAN1112  [SOT-223(FAN1112)]

### Nets
1V2: C136.2 C137.2 C138.2 C139.2 C140.2 C141.2 C142.2 C143.2 C145.1 C146.1 U15.2(VOUT) U15.4
2V5: C112.1 C113.2 C114.2 C115.2 C116.2 C117.2 C118.2 C119.2 C120.2 C121.2 C122.2 C123.2 C124.2 C125.2 C126.2 C127.2 C128.2 C130.1 C131.1 TP_4.1(TP) U14.2(Vout) U14.4(VOUT)
3V3: C68.2 C69.2 C70.2 C71.2 C72.1 C73.1 C74.1 C75.2 C76.2 C77.2 C78.2 C79.2 C80.2 C81.2 C82.2 C83.2 C84.2 C85.2 C87.1 C88.1 C90.2 C91.2 C92.2 C93.2 C94.2 C95.2 C96.2 C97.2 C98.2 C99.2 C100.2 C144.1 TP_3.1(TP) U13.2(Vout) U13.4(Vo) U15.3(VIN)
5V: C12.1 C16.1 C61.1 C62.1 C63.1 C64.1 C65.1 C66.1 C67.1 C86.1 C129.1 C162.1 C163.1 C164.1 C165.1 C166.1 D1.1 D2.2(K) SW2.2(NO) TP_2.1(TP) U13.3(IN) U14.3(Vin)  [project net A_LCD]
AGND: C61.2 C62.2 C63.2 C64.2 C65.2 C66.2
GND: C12.2 C16.2 C67.2 C68.1 C69.1 C70.1 C71.1 C72.2 C73.2 C74.2 C75.1 C76.1 C77.1 C78.1 C79.1 C80.1 C81.1 C82.1 C83.1 C84.1 C85.1 C86.2 C87.2 C88.2 C90.1 C91.1 C92.1 C93.1 C94.1 C95.1 C96.1 C97.1 C98.1 C99.1 C100.1 C112.2 C113.1 C114.1 C115.1 C116.1 C117.1 C118.1 C119.1 C120.1 C121.1 C122.1 C123.1 C124.1 C125.1 C126.1 C127.1 C128.1 C129.2 C130.2 C131.2 C136.1 C137.1 C138.1 C139.1 C140.1 C141.1 C142.1 C143.1 C144.2 C145.2 C146.2 C162.2 C163.2 C164.2 C165.2 C166.2 D2.1(A) J2.2 J2.2A J2.2B J2.3 J2.3A J2.3B R42.1 U13.1(ADJ/GND) U14.1(GND) U15.1(GND)
NetD1_2: D1.2 R42.2
NetJ2_1: J2.1 J2.1A J2.1B SW2.1(COMMON)

### Notes on the sheet
- FPGA VCCO PWR：3V3
- FPGA VCCAUX PWR : 2V5
- FPGA VCCINT PWR : 1V2

### Library data of the parts
C12 C16 C62 C64 C66 C67 C72-C74 C86-C88 C112 C129-C131 C144-C146 = Cap Pol1: Polarized Capacitor (Radial); Published: 8-Jun-2000; LatestRevisionDate: 17-Jul-2002; LatestRevisionNote: Re-released for DXP Platform.; PackageReference: RB7.6-15; Publisher: Altium Limited
C61 C63 C65 C68-C71 C75-C85 C90-C100 C113-C128 C136-C143 C162-C166 = Cap: Capacitor; Published: 8-Jun-2000; LatestRevisionDate: 17-Jul-2002; LatestRevisionNote: Re-released for DXP Platform.; PackageReference: RAD-0.3; Publisher: Altium Limited
D1 = LED: Text Field1: 40; Text Field2: 20
D2 = Diode 11DQ03: Schottky Rectifier; Published: 8-Jun-2000; LatestRevisionDate: 17-Jul-2002; LatestRevisionNote: Re-released for DXP Platform.; DatasheetDocument: Dec-1997; PackageReference: DO-204AL; Publisher: Altium Limited; Code_JEDEC: DO-204-AL; ComponentLink1Description: Manufacturer Link; ComponentLink1URL: http://www.irf.com/; ComponentLink2Description: Datasheet; ComponentLink2URL: http://www.irf.com/product-info/datasheets/data/11dq03.pdf
J2 = PWR2.5: Low Voltage Power Supply Connector; Published: 17-Dec-2003; DatasheetDocument: 09-May-2002; Publisher: Altium Limited; ComponentLink1Description: Manufacturer Link; ComponentLink1URL: http://domino.kycon.com/internet/Products.html
R42 = Res1: Resistor; Published: 8-Jun-2000; LatestRevisionDate: 17-Jul-2002; LatestRevisionNote: Re-released for DXP Platform.; PackageReference: AXIAL-0.3; Publisher: Altium Limited
SW2 = SW-SPST: Single-Pole, Single-Throw Switch; Published: 24-Mar-1999; LatestRevisionDate: 17-Jul-2002; LatestRevisionNote: Re-released for DXP Platform.; PackageReference: SPST-2; Publisher: Altium Limited
TP_2-TP_4 = TEST POINT_0: Right: 10; Bottom: 20
U13 = PWR_LM1117S-3.3
U14 = VOLTREG

## Sheet SH09-PWR2.SchDoc
size A4
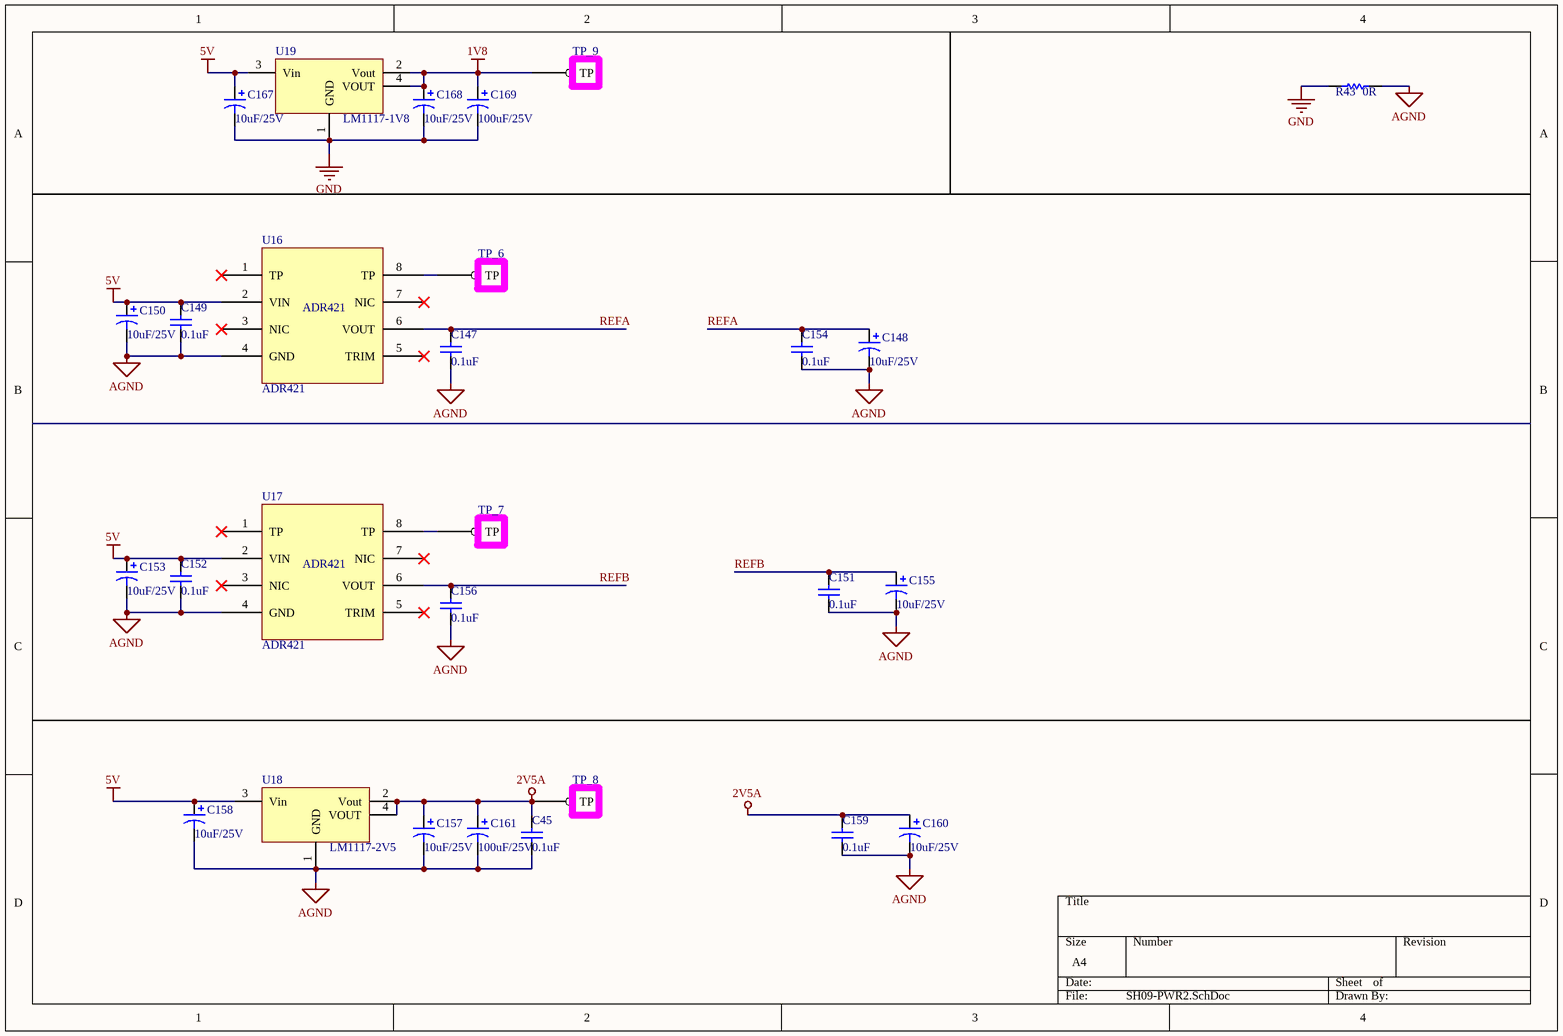
[diagram p8: SH09-PWR2.SchDoc]

### Parts
C45  value 0.1uF  [1608[0603]]  (hidden comment: Cap,0.1uF/0603)
C147  value 0.1uF  [1608[0603]]  (hidden comment: Cap,0.1uF/0603)
C148  value 10uF/25V  [1206[3216]]  (hidden comment: Cap Pol,10uF/25V,1206)
C149  value 0.1uF  [1608[0603]]  (hidden comment: Cap,0.1uF/0603)
C150  value 10uF/25V  [1206[3216]]  (hidden comment: Cap Pol,10uF/25V,1206)
C151  value 0.1uF  [1608[0603]]  (hidden comment: Cap,0.1uF/0603)
C152  value 0.1uF  [1608[0603]]  (hidden comment: Cap,0.1uF/0603)
C153  value 10uF/25V  [1206[3216]]  (hidden comment: Cap Pol,10uF/25V,1206)
C154  value 0.1uF  [1608[0603]]  (hidden comment: Cap,0.1uF/0603)
C155  value 10uF/25V  [1206[3216]]  (hidden comment: Cap Pol,10uF/25V,1206)
C156  value 0.1uF  [1608[0603]]  (hidden comment: Cap,0.1uF/0603)
C157  value 10uF/25V  [1206[3216]]  (hidden comment: Cap Pol,10uF/25V,1206)
C158  value 10uF/25V  [1206[3216]]  (hidden comment: Cap Pol,10uF/25V,1206)
C159  value 0.1uF  [1608[0603]]  (hidden comment: Cap,0.1uF/0603)
C160  value 10uF/25V  [1206[3216]]  (hidden comment: Cap Pol,10uF/25V,1206)
C161  value 100uF/25V  [1210[3528]]  (hidden comment: Cap Pol,100uF/25V,1210)
C167  value 10uF/25V  [1206[3216]]  (hidden comment: Cap Pol,10uF/25V,1206)
C168  value 10uF/25V  [1206[3216]]  (hidden comment: Cap Pol,10uF/25V,1206)
C169  value 100uF/25V  [1210[3528]]  (hidden comment: Cap Pol,100uF/25V,1210)
R43  value 0R  [2012[0805]]  (hidden comment: Res,0R/0805)
TP_6  REFA  [MYTP]  (value not drawn)
TP_7  REFB  [MYTP]  (value not drawn)
TP_8  2V5  [MYTP]  (value not drawn)
TP_9  1V8  [MYTP]  (value not drawn)
U16  ADR421  [SOIC127P600X175-8N]
U17  ADR421  [SOIC127P600X175-8N]
U18  LM1117-2V5  [SOT223P700X180-4N]
U19  LM1117-1V8  [SOT223P700X180-4N]

### Nets
1V8: C168.1 C169.1 TP_9.1(TP) U19.2(Vout) U19.4(VOUT)
2V5A: C45.1 C157.1 C159.1 C160.1 C161.1 TP_8.1(TP) U18.2(Vout) U18.4(VOUT)
5V: C149.1 C150.1 C152.1 C153.1 C158.1 C167.1 U16.2(VIN) U17.2(VIN) U18.3(Vin) U19.3(Vin)  [project net A_LCD]
AGND: C45.2 C147.2 C148.2 C149.2 C150.2 C151.2 C152.2 C153.2 C154.2 C155.2 C156.2 C157.2 C158.2 C159.2 C160.2 C161.2 R43.1 U16.4(GND) U17.4(GND) U18.1(GND)
GND: C167.2 C168.2 C169.2 R43.2 U19.1(GND)
REFA: C147.1 C148.1 C154.1 U16.6(VOUT)
REFB: C151.1 C155.1 C156.1 U17.6(VOUT)
NetTP_6_1: TP_6.1(TP) U16.8(TP)
NetTP_7_1: TP_7.1(TP) U17.8(TP)

Not connected (* = marked no-connect by the designer): U16 1(TP)* 3(NIC)* 5(TRIM)* 7(NIC)*; U17 1(TP)* 3(NIC)* 5(TRIM)* 7(NIC)*

### Library data of the parts
C45 C147 C149 C151 C152 C154 C156 C159 = Cap: Capacitor; Published: 8-Jun-2000; LatestRevisionDate: 17-Jul-2002; LatestRevisionNote: Re-released for DXP Platform.; PackageReference: RAD-0.3; Publisher: Altium Limited
C148 C150 C153 C155 C157 C158 C160 C161 C167-C169 = Cap Pol1: Polarized Capacitor (Radial); Published: 8-Jun-2000; LatestRevisionDate: 17-Jul-2002; LatestRevisionNote: Re-released for DXP Platform.; PackageReference: RB7.6-15; Publisher: Altium Limited
R43 = Res1: Resistor; Published: 8-Jun-2000; LatestRevisionDate: 17-Jul-2002; LatestRevisionNote: Re-released for DXP Platform.; PackageReference: AXIAL-0.3; Publisher: Altium Limited
TP_6-TP_9 = TEST POINT_0: Right: 10; Bottom: 20
U16 U17 = PWR_ADR421: Ultraprecision Low Noise, 2.048 V/2.500 V/  3.00 V/5.00 V XFET? Voltage References
U18 U19 = VOLTREG

## Sheet SH10-ASSI.SchDoc
size A4
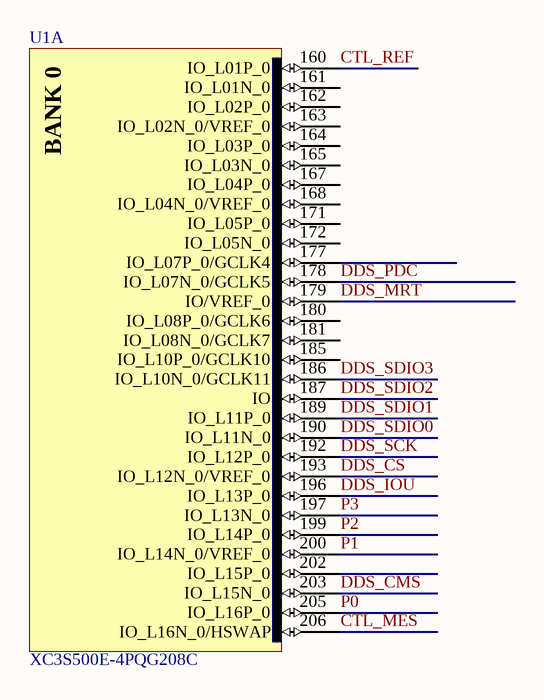
[diagram p9: SH10-ASSI.SchDoc]

### Parts
U1  XC3S500E-4PQG208C  [PQG208_N]  (part A of 8)

### Nets
CTL_MES: U1.206(IO_L16N_0/HSWAP)
CTL_REF: U1.160(IO_L01P_0)
DDS_~{CS}: U1.193(IO_L12N_0/VREF_0)
DDS_CMS: U1.203(IO_L15N_0)
DDS_IOU: U1.196(IO_L13P_0)
DDS_MRT: U1.179(IO/VREF_0)
DDS_PDC: U1.178(IO_L07N_0/GCLK5)
DDS_SCK: U1.192(IO_L12P_0)
DDS_SDIO0: U1.190(IO_L11N_0)
DDS_SDIO1: U1.189(IO_L11P_0)
DDS_SDIO2: U1.187(IO)
DDS_SDIO3: U1.186(IO_L10N_0/GCLK11)
P0: U1.205(IO_L16P_0)
P1: U1.200(IO_L14N_0/VREF_0)
P2: U1.199(IO_L14P_0)
P3: U1.197(IO_L13N_0)

Not connected (* = marked no-connect by the designer): U1 161(IO_L01N_0) 162(IO_L02P_0) 163(IO_L02N_0/VREF_0) 164(IO_L03P_0) 165(IO_L03N_0) 167(IO_L04P_0) 168(IO_L04N_0/VREF_0) 171(IO_L05P_0) 172(IO_L05N_0) 177(IO_L07P_0/GCLK4) 180(IO_L08P_0/GCLK6) 181(IO_L08N_0/GCLK7) 185(IO_L10P_0/GCLK10) 202(IO_L15P_0)

### Notes on the sheet
- (in symbol XC3S500E-4PQG208C, part A) BANK 0

### Library data of the parts
U1 = XC3S500E-4PQG208C: as U1 on sheet SH02-PERI; Published: 6-Jun-2005; LatestRevisionDate: 13-Apr-2006; LatestRevisionNote: IPC-7351 Footprint Added.; DatasheetVersion: 16-Mar-2007; PackageVersion: ver1.2, Jun-2004; PackageReference: PQG208; Publisher: Altium Limited; PackageDescription: 208-Pin Plastic Quad Flat Pack (PQG208) - Pb-Free; Code_JEDEC: MS-029-FA-1; ComponentLink1Description: Manufacturer Link; ComponentLink1URL: http://www.xilinx.com/products/silicon_solutions/fpgas/spartan_series/spartan3e_fpgas/index.htm; ComponentLink2Description: Datasheet; ComponentLink2URL: http://direct.xilinx.com/bvdocs/publications/ds312.pdf

## Nets that join several sheets
1V2: SH07-COREPWR (U1.13 U1.67 U1.117 U1.170), SH08-PWR1 (12 pins)
1V8: SH05-DDS (47 pins), SH09-PWR2 (5 pins)
2V5: SH07-COREPWR (8 pins), SH08-PWR1 (22 pins)
2V5A: SH03-AD (U6.9), SH09-PWR2 (8 pins)
3V3: SH02-PERI (24 pins), SH03-AD (U6.16), SH06-UI (5 pins), SH05-DDS (C46.1 C47.1 U9.49), SH07-COREPWR (12 pins), SH08-PWR1 (36 pins)
A_LCD: SH03-AD (U5.3 U7.6 U8.3), SH06-UI (5 pins), SH05-DDS (U10.4 U11.4), SH08-PWR1 (22 pins), SH09-PWR2 (10 pins)
AGND: SH03-AD (20 pins), SH08-PWR1 (6 pins), SH09-PWR2 (20 pins)
GND: SH02-PERI (20 pins), SH03-AD (U6.12), SH06-UI (11 pins), SH05-DDS (63 pins), SH07-COREPWR (20 pins), SH08-PWR1 (82 pins), SH09-PWR2 (5 pins)
1DIR_LCD: SH04-DSP (U1.126), SH06-UI (R35.1 R38.1)
2DIR_LCD: SH04-DSP (U1.152), SH06-UI (R34.1 R40.1)
AD_~{CS}: SH02-PERI (U1.100), SH03-AD (U6.10)
AD_SCLK: SH02-PERI (U1.90), SH03-AD (U6.15)
CLK_FPGA_50M: SH02-PERI (R3.2), SH07-COREPWR (U1.183)
CTL_MES: SH05-DDS (U10.6), SH10-ASSI (U1.206)
CTL_REF: SH05-DDS (U11.6), SH10-ASSI (U1.160)
DB0_FPGA_LCD: SH04-DSP (U1.133), SH06-UI (U12.43)
DB1_FPGA_LCD: SH04-DSP (U1.134), SH06-UI (U12.41)
DB2_FPGA_LCD: SH04-DSP (U1.135), SH06-UI (U12.40)
DB3_FPGA_LCD: SH04-DSP (U1.137), SH06-UI (U12.38)
DB4_FPGA_LCD: SH04-DSP (U1.138), SH06-UI (U12.37)
DB5_FPGA_LCD: SH04-DSP (U1.139), SH06-UI (U12.36)
DB6_FPGA_LCD: SH04-DSP (U1.140), SH06-UI (U12.35)
DB7_FPGA_LCD: SH04-DSP (U1.144), SH06-UI (U12.33)
DDS_CMS: SH05-DDS (U9.24), SH10-ASSI (U1.203)
DDS_IOU: SH05-DDS (U9.46), SH10-ASSI (U1.196)
DDS_MRT: SH05-DDS (U9.3), SH10-ASSI (U1.179)
DDS_PDC: SH05-DDS (U9.4), SH10-ASSI (U1.178)
DDS_SCK: SH05-DDS (U9.48), SH10-ASSI (U1.192)
DDS_SDIO0: SH05-DDS (U9.50), SH10-ASSI (U1.190)
DDS_SDIO1: SH05-DDS (U9.51), SH10-ASSI (U1.189)
DDS_SDIO2: SH05-DDS (U9.52), SH10-ASSI (U1.187)
DDS_SDIO3: SH05-DDS (U9.53), SH10-ASSI (U1.186)
E_FPGA_LCD: SH04-DSP (U1.132), SH06-UI (U12.44)
MISO: SH02-PERI (P3.3 R49.2), SH05-DDS (R55.2)
MOSI: SH02-PERI (P3.2 R50.2), SH05-DDS (R54.2)
NU_FPGA_1: SH04-DSP (U1.145), SH06-UI (U12.32)
NU_FPGA_2: SH04-DSP (U1.146), SH06-UI (U12.30)
NU_FPGA_3: SH04-DSP (U1.147), SH06-UI (U12.29)
NU_FPGA_4: SH04-DSP (U1.150), SH06-UI (U12.27)
NU_FPGA_5: SH04-DSP (U1.151), SH06-UI (U12.26)
NU_SPI_1: SH02-PERI (P3.7 R6.2 R53.1), SH05-DDS (R56.2)
NU_SPI_2: SH02-PERI (P3.8 R5.2 R52.1), SH05-DDS (R57.2)
~{OE}_LCD: SH04-DSP (U1.127), SH06-UI (R36.1 R37.1 R39.1)
P0: SH05-DDS (U9.40), SH10-ASSI (U1.205)
P1: SH05-DDS (U9.41), SH10-ASSI (U1.200)
P2: SH05-DDS (U9.42), SH10-ASSI (U1.199)
P3: SH05-DDS (U9.43), SH10-ASSI (U1.197)
R/W_FPGA_LCD: SH04-DSP (U1.129), SH06-UI (U12.46)
REFA: SH03-AD (U6.3 U7.1), SH09-PWR2 (C147.1 C148.1 C154.1 U16.6)
REFB: SH03-AD (U6.6 U7.3), SH09-PWR2 (C151.1 C155.1 C156.1 U17.6)
RS_FPGA_LCD: SH04-DSP (U1.128), SH06-UI (U12.47)
RX232_FPGA: SH02-PERI (U3.9), SH04-DSP (U1.107)
SDATA_A: SH02-PERI (U1.94), SH03-AD (R15.2)
SDATA_B: SH02-PERI (U1.98), SH03-AD (R18.2)
SPI_R: SH02-PERI (P3.5 R47#1.2), SH05-DDS (U1.23)
SPI_SCLK: SH02-PERI (P3.1 R51.2), SH05-DDS (U1.34)
SPI_W: SH02-PERI (P3.6 R46#1.2), SH05-DDS (U1.22)
SS: SH02-PERI (P3.4 R48.2), SH05-DDS (U1.24)
TX232_FPGA: SH02-PERI (U3.10), SH04-DSP (U1.106)